# EAGLE schematic Beilage xx (EAGLE 9.6.2)
ABTEILUNG: Technische Informatik; BEARBEITER: Grundner, Ihninger; DATUM: 2021/11/6; DOKUMENTART: Schaltplan; GEZ: GruS; ID: 4AHEL; REV: 1; SCHALTPLAN: Sequencer; STATUS: Prototyp; VER: 1.0

## Sheet 1 of 10: Voltage Regulator PCB conversion From 12V AC input to: 1.33V 5V +12V -12V with buck Converters and Rectifiers
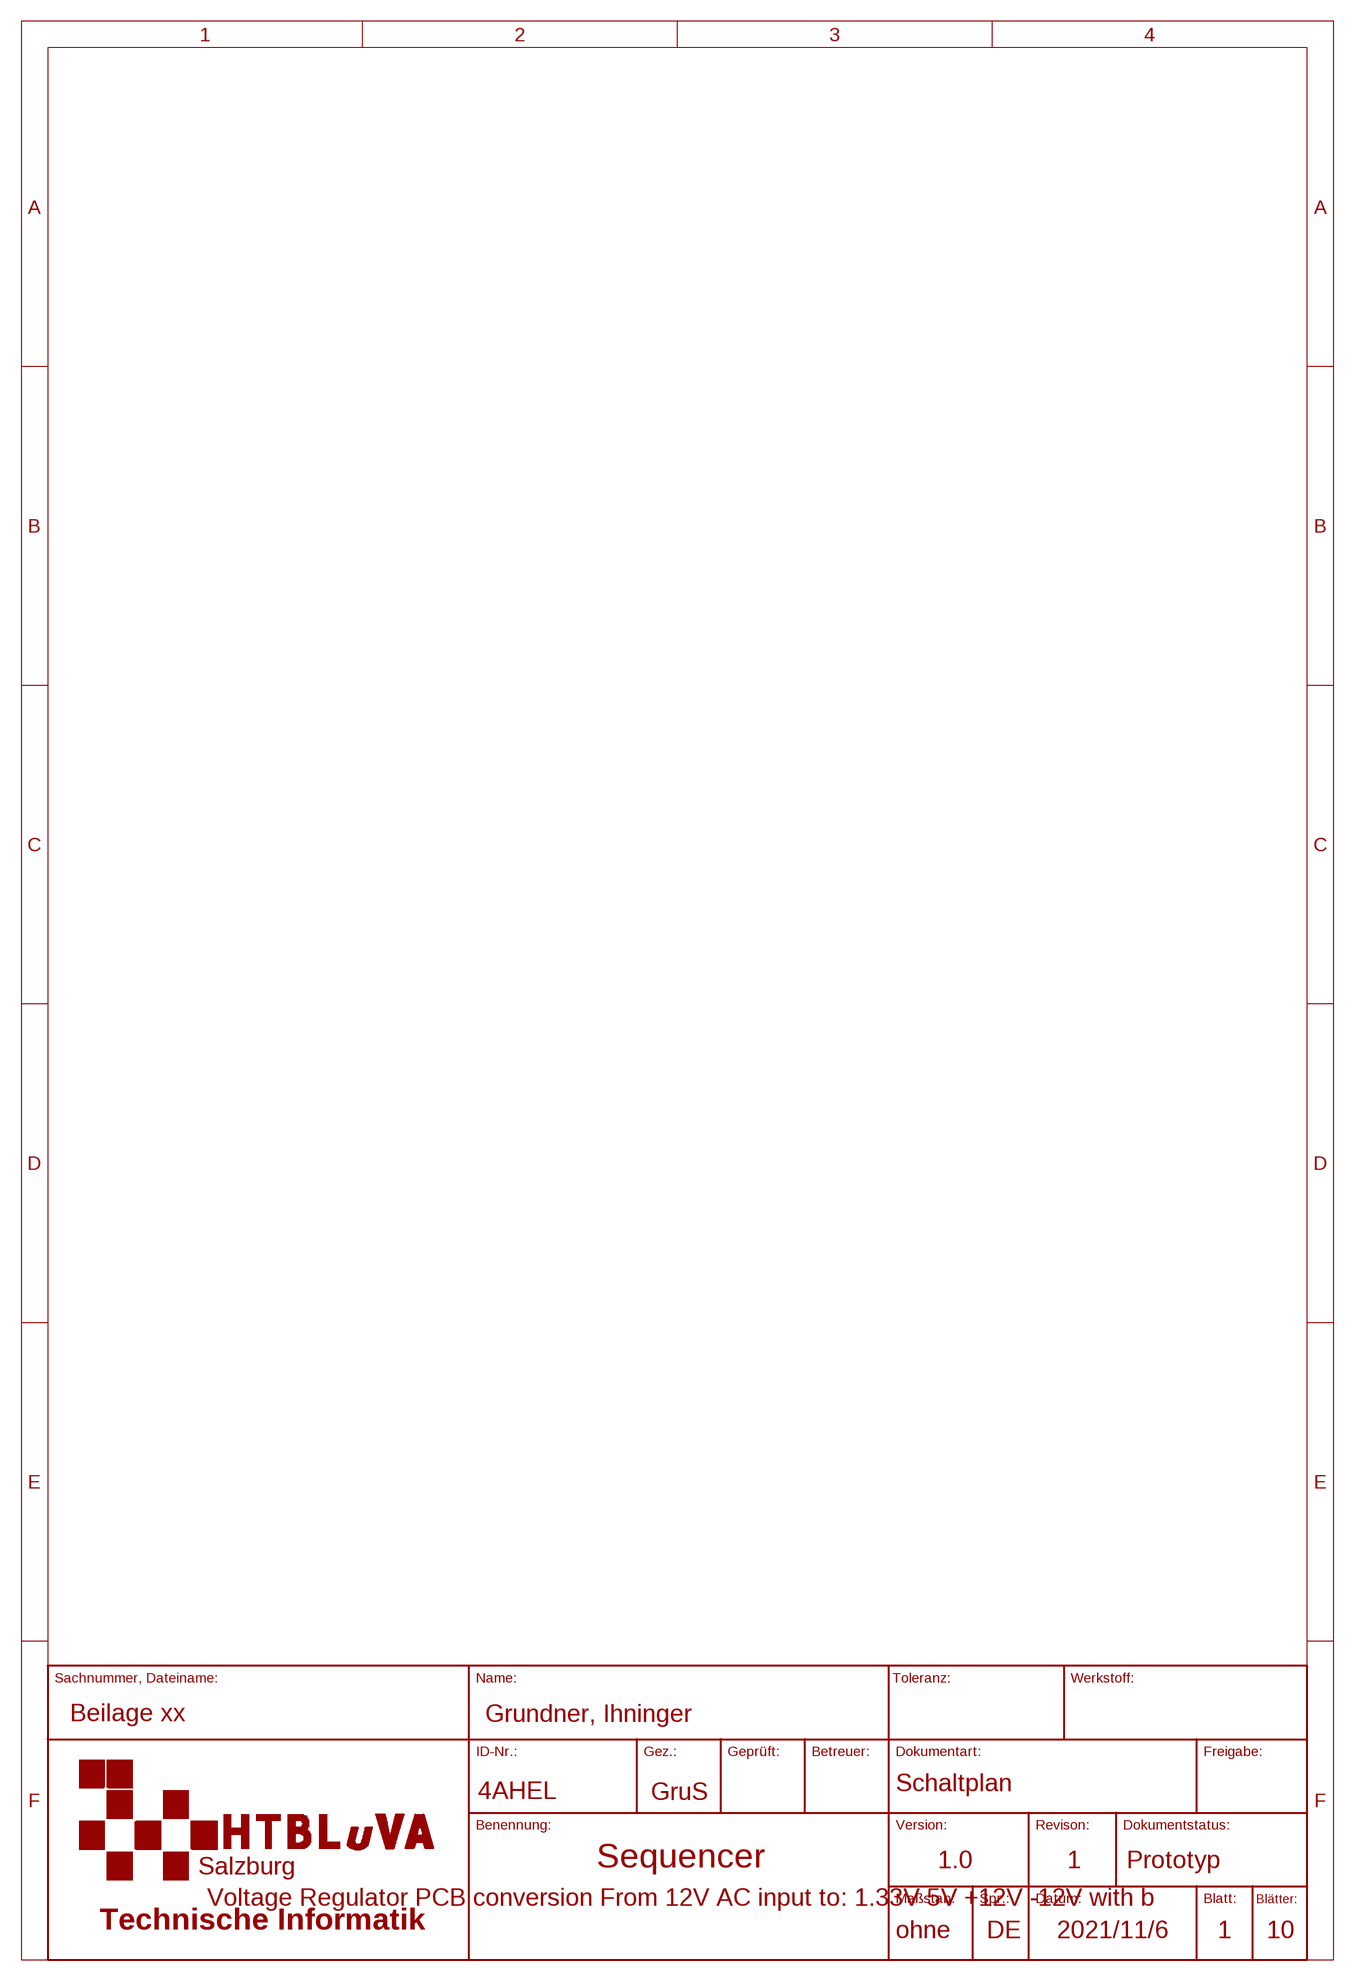
[diagram p0: schematic, sheet 1]

## Sheet 2 of 10: Jack Connector PCBs
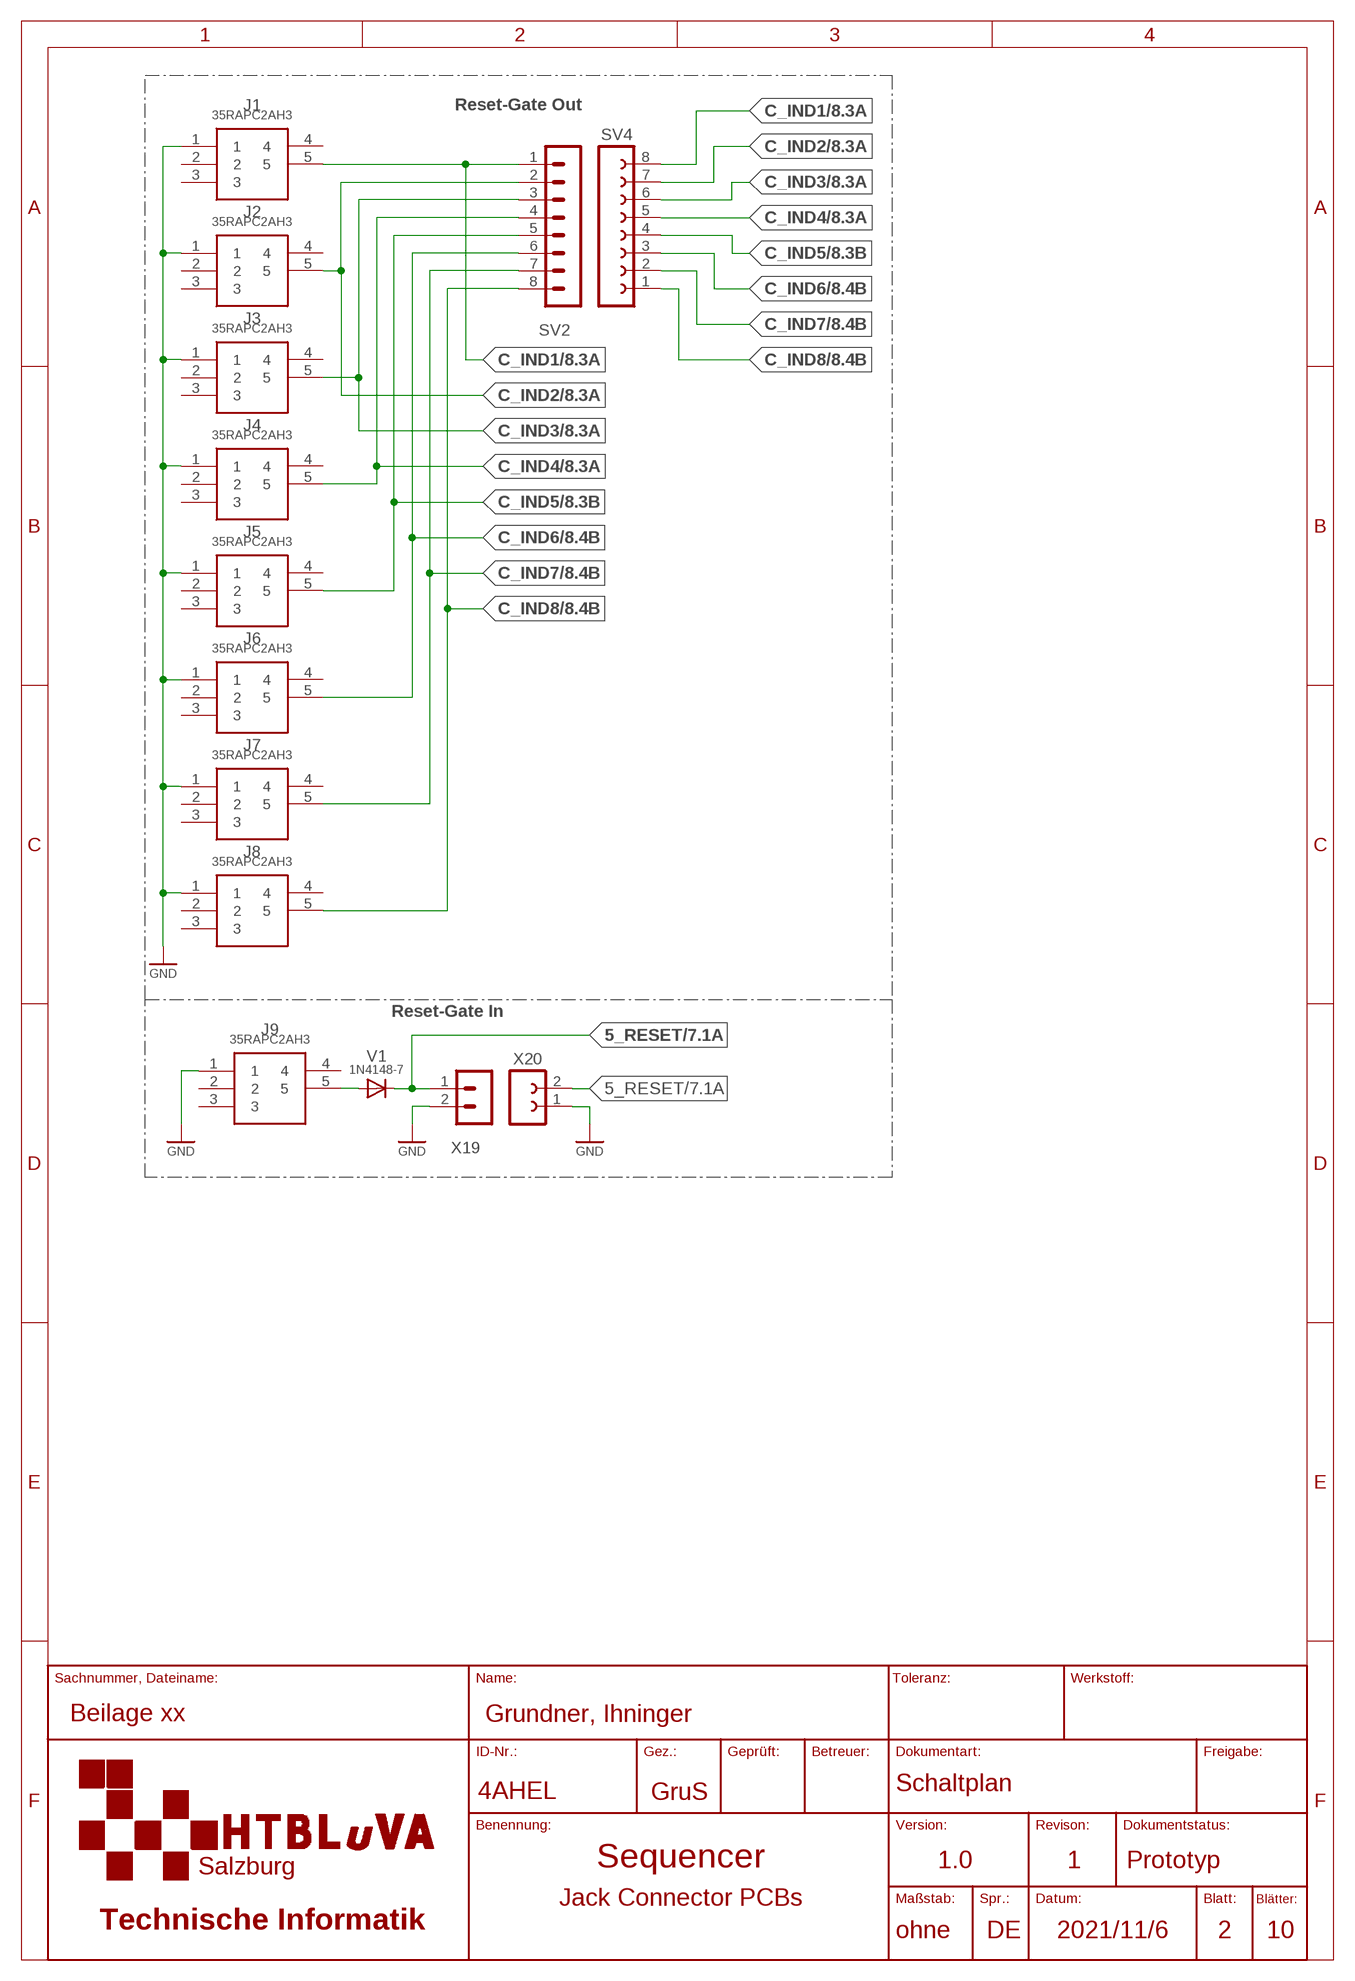
[diagram p1: schematic, sheet 2]

### Parts
J1  35RAPC2AH3  [35RAPC2AH3]
J2  35RAPC2AH3  [35RAPC2AH3]
J3  35RAPC2AH3  [35RAPC2AH3]
J4  35RAPC2AH3  [35RAPC2AH3]
J5  35RAPC2AH3  [35RAPC2AH3]
J6  35RAPC2AH3  [35RAPC2AH3]
J7  35RAPC2AH3  [35RAPC2AH3]
J8  35RAPC2AH3  [35RAPC2AH3]
J9  35RAPC2AH3  [35RAPC2AH3]
SV2  MA08-1W  [MA08-1W]
SV4  FE08-1  [FE08]
V1  1N4148-7  [DO35-7]
X19  MA02-1W  [MA02-1W]
X20  FE02-10.8MM  [FE02-1]

### Nets
5_RESET: V1.C X19.1 X20.2 ; also sheet 7,9
C_IND1: J1.5 SV2.1 SV4.8 ; also sheet 8
C_IND2: J2.5 SV2.2 SV4.7 ; also sheet 8
C_IND3: J3.5 SV2.3 SV4.6 ; also sheet 8
C_IND4: J4.5 SV2.4 SV4.5 ; also sheet 8
C_IND5: J5.5 SV2.5 SV4.4 ; also sheet 8
C_IND6: J6.5 SV2.6 SV4.3 ; also sheet 8
C_IND7: J7.5 SV2.7 SV4.2 ; also sheet 8
C_IND8: J8.5 SV2.8 SV4.1 ; also sheet 8
GND: J1.1 J2.1 J3.1 J4.1 J5.1 J6.1 J7.1 J8.1 J9.1 X19.2 X20.1 ; also sheet 3,4,5,6,7,8,9,10
N$98: J9.5 V1.A
Unconnected: J1.2 J1.3 J1.4 J2.2 J2.3 J2.4 J3.2 J3.3 J3.4 J4.2 J4.3 J4.4 J5.2 J5.3 J5.4 J6.2 J6.3 J6.4 J7.2 J7.3 J7.4 J8.2 J8.3 J8.4 J9.2 J9.3 J9.4

### Notes on the sheet
- Reset-Gate Out
- Reset-Gate In

## Sheet 3 of 10: Poti Connector PCBs Vertical PCBs to connect potis to Frontpanel
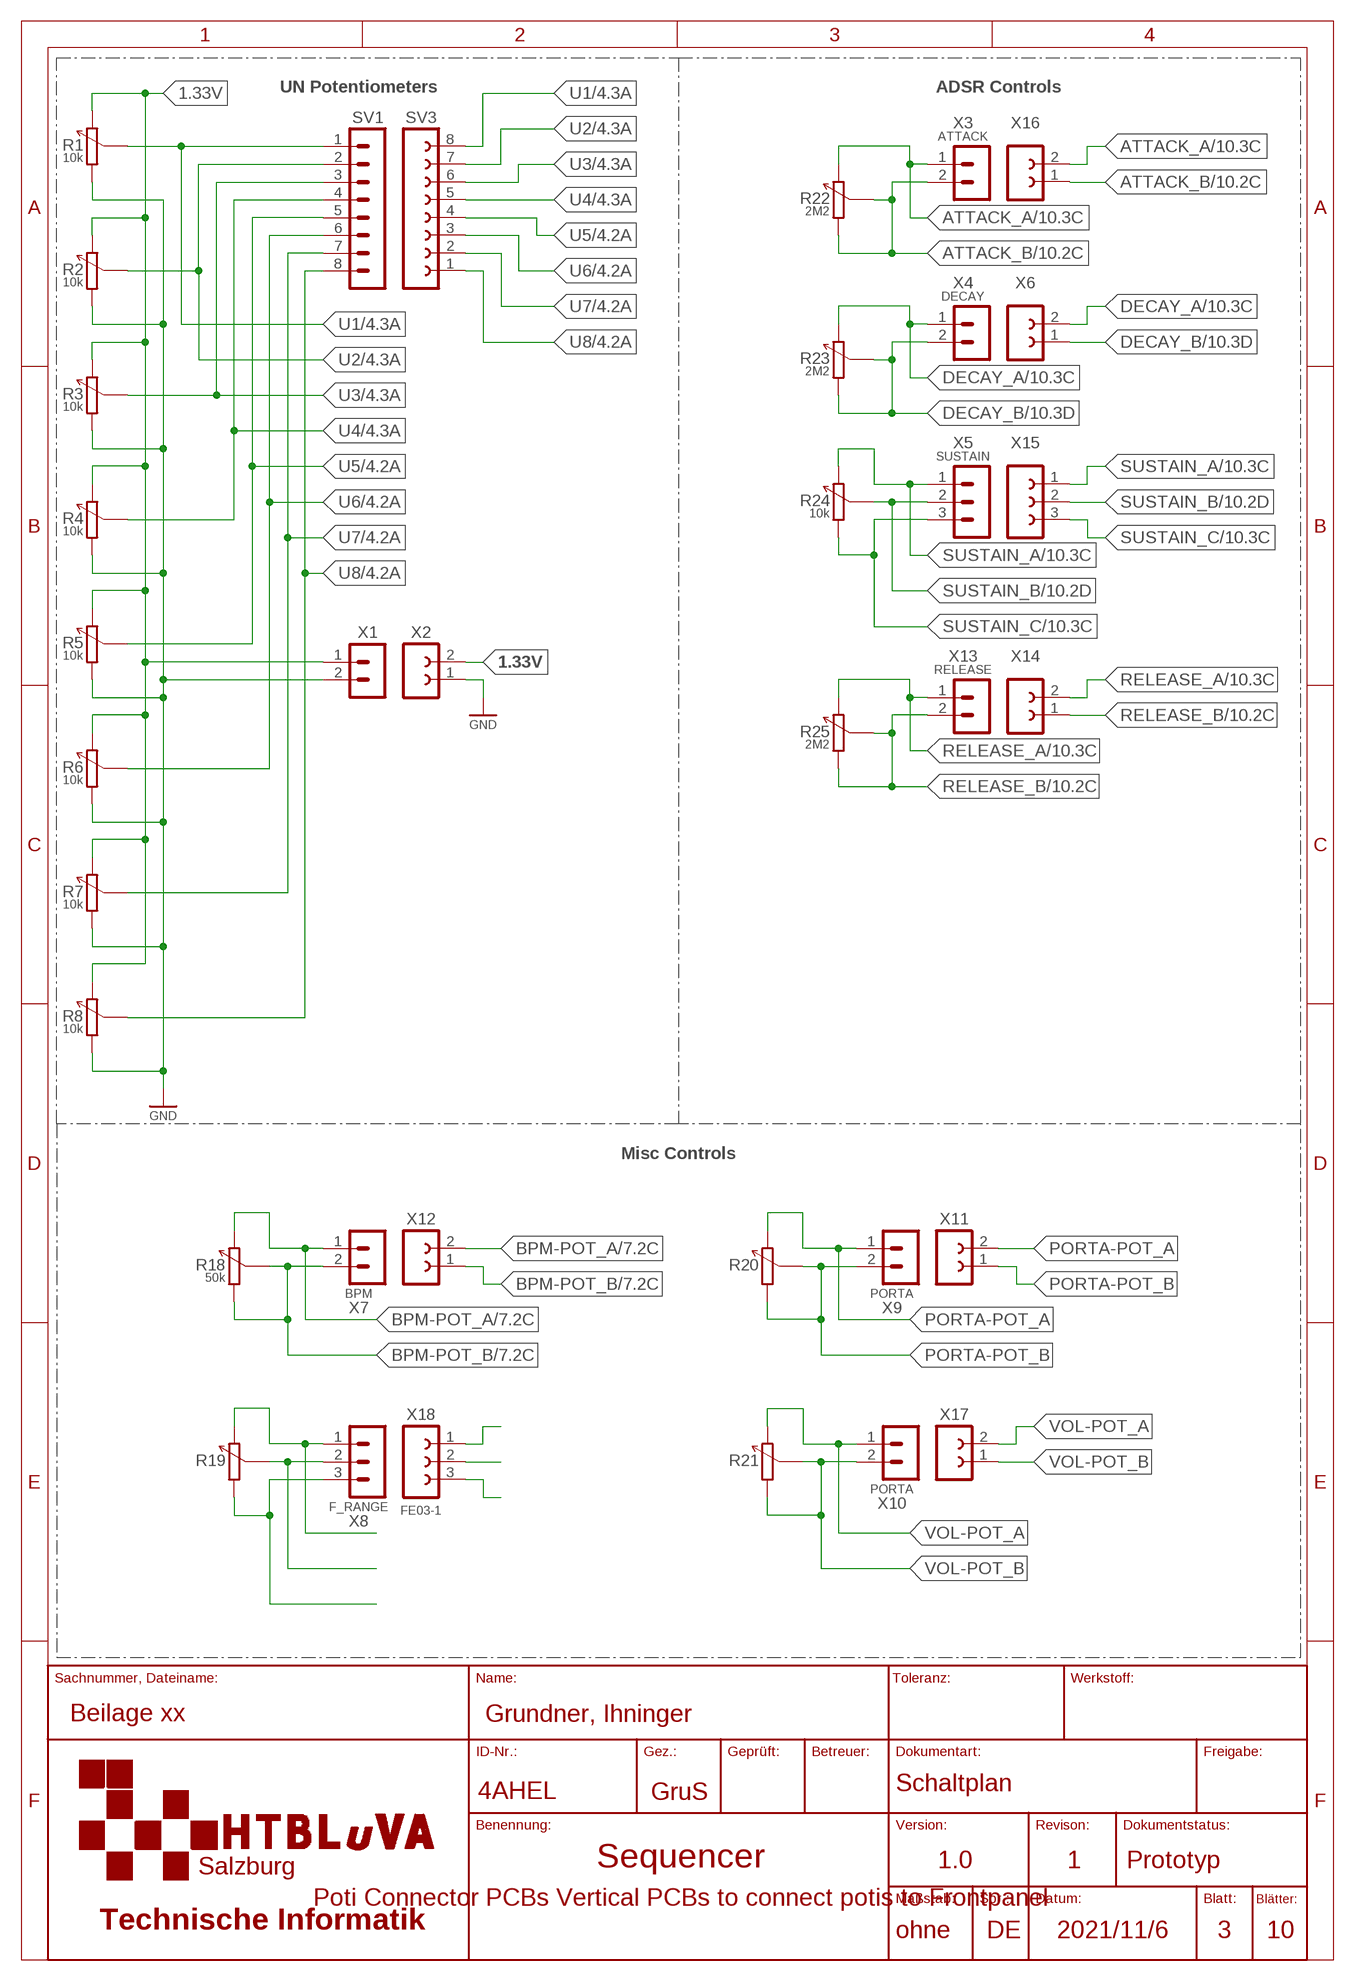
[diagram p2: schematic, sheet 3]

### Parts
R1  10k  R-POT  [R-POT-PANEL-MOUNT]
R2  10k  R-POT  [R-POT-PANEL-MOUNT]
R3  10k  R-POT  [R-POT-PANEL-MOUNT]
R4  10k  R-POT  [R-POT-PANEL-MOUNT]
R5  10k  R-POT  [R-POT-PANEL-MOUNT]
R6  10k  R-POT  [R-POT-PANEL-MOUNT]
R7  10k  R-POT  [R-POT-PANEL-MOUNT]
R8  10k  R-POT  [R-POT-PANEL-MOUNT]
R18  50k  R-POT  [R-POT-PANEL-MOUNT]
R19  R-POT  [R-POT-PANEL-MOUNT]
R20  R-POT  [R-POT-PANEL-MOUNT]
R21  R-POT  [R-POT-PANEL-MOUNT]
R22  2M2  R-POT  [R-POT-PANEL-MOUNT]
R23  2M2  R-POT  [R-POT-PANEL-MOUNT]
R24  10k  R-POT  [R-POT-PANEL-MOUNT]
R25  2M2  R-POT  [R-POT-PANEL-MOUNT]
SV1  MA08-1W  [MA08-1W]
SV3  FE08-1  [FE08]
X1  MA02-1W  [MA02-1W]
X2  FE02-10.8MM  [FE02-1]
X3  ATTACK  MA02-1W  [MA02-1W]
X4  DECAY  MA02-1W  [MA02-1W]
X5  SUSTAIN  MA03-1W  [MA03-1W]
X6  FE02-10.8MM  [FE02-1]
X7  BPM  MA02-1W  [MA02-1W]
X8  F_RANGE  MA03-1W  [MA03-1W]
X9  PORTA  MA02-1W  [MA02-1W]
X10  PORTA  MA02-1W  [MA02-1W]
X11  FE02-10.8MM  [FE02-1]
X12  FE02-10.8MM  [FE02-1]
X13  RELEASE  MA02-1W  [MA02-1W]
X14  FE02-10.8MM  [FE02-1]
X15  FE03-1  [FE03-1]
X16  FE02-10.8MM  [FE02-1]
X17  FE02-10.8MM  [FE02-1]
X18  FE03-1  [FE03-1]

### Nets
1.33V: R1.3 R2.3 R3.3 R4.3 R5.3 R6.3 R7.3 R8.3 X1.1 X2.2
ATTACK_A: R22.3 X3.1 X16.2 ; also sheet 10
ATTACK_B: R22.1 R22.2 X3.2 X16.1 ; also sheet 10
BPM-POT_A: R18.3 X7.1 X12.2 ; also sheet 7
BPM-POT_B: R18.1 R18.2 X7.2 X12.1 ; also sheet 7
DECAY_A: R23.3 X4.1 X6.2 ; also sheet 10
DECAY_B: R23.1 R23.2 X4.2 X6.1 ; also sheet 10
GND: R1.1 R2.1 R3.1 R4.1 R5.1 R6.1 R7.1 R8.1 X1.2 X2.1 ; also sheet 2,4,5,6,7,8,9,10
N$21: R19.2 X8.2
N$35: R19.1 X8.3
N$36: R19.3 X8.1
N$78: X18.1
N$80: X18.2
N$82: X18.3
PORTA-POT_A: R20.3 X9.1 X11.2
PORTA-POT_B: R20.1 R20.2 X9.2 X11.1
RELEASE_A: R25.3 X13.1 X14.2 ; also sheet 10
RELEASE_B: R25.1 R25.2 X13.2 X14.1 ; also sheet 10
SUSTAIN_A: R24.3 X5.1 X15.1 ; also sheet 10
SUSTAIN_B: R24.2 X5.2 X15.2 ; also sheet 10
SUSTAIN_C: R24.1 X5.3 X15.3 ; also sheet 10
U1: R1.2 SV1.1 SV3.8 ; also sheet 4
U2: R2.2 SV1.2 SV3.7 ; also sheet 4
U3: R3.2 SV1.3 SV3.6 ; also sheet 4
U4: R4.2 SV1.4 SV3.5 ; also sheet 4
U5: R5.2 SV1.5 SV3.4 ; also sheet 4
U6: R6.2 SV1.6 SV3.3 ; also sheet 4
U7: R7.2 SV1.7 SV3.2 ; also sheet 4
U8: R8.2 SV1.8 SV3.1 ; also sheet 4
VOL-POT_A: R21.3 X10.1 X17.2
VOL-POT_B: R21.1 R21.2 X10.2 X17.1

### Notes on the sheet
- UN Potentiometers | ADSR Controls
- Misc Controls

## Sheet 4 of 10: Main PCB: ASP Analog CV Input Signal Processing status LEDs
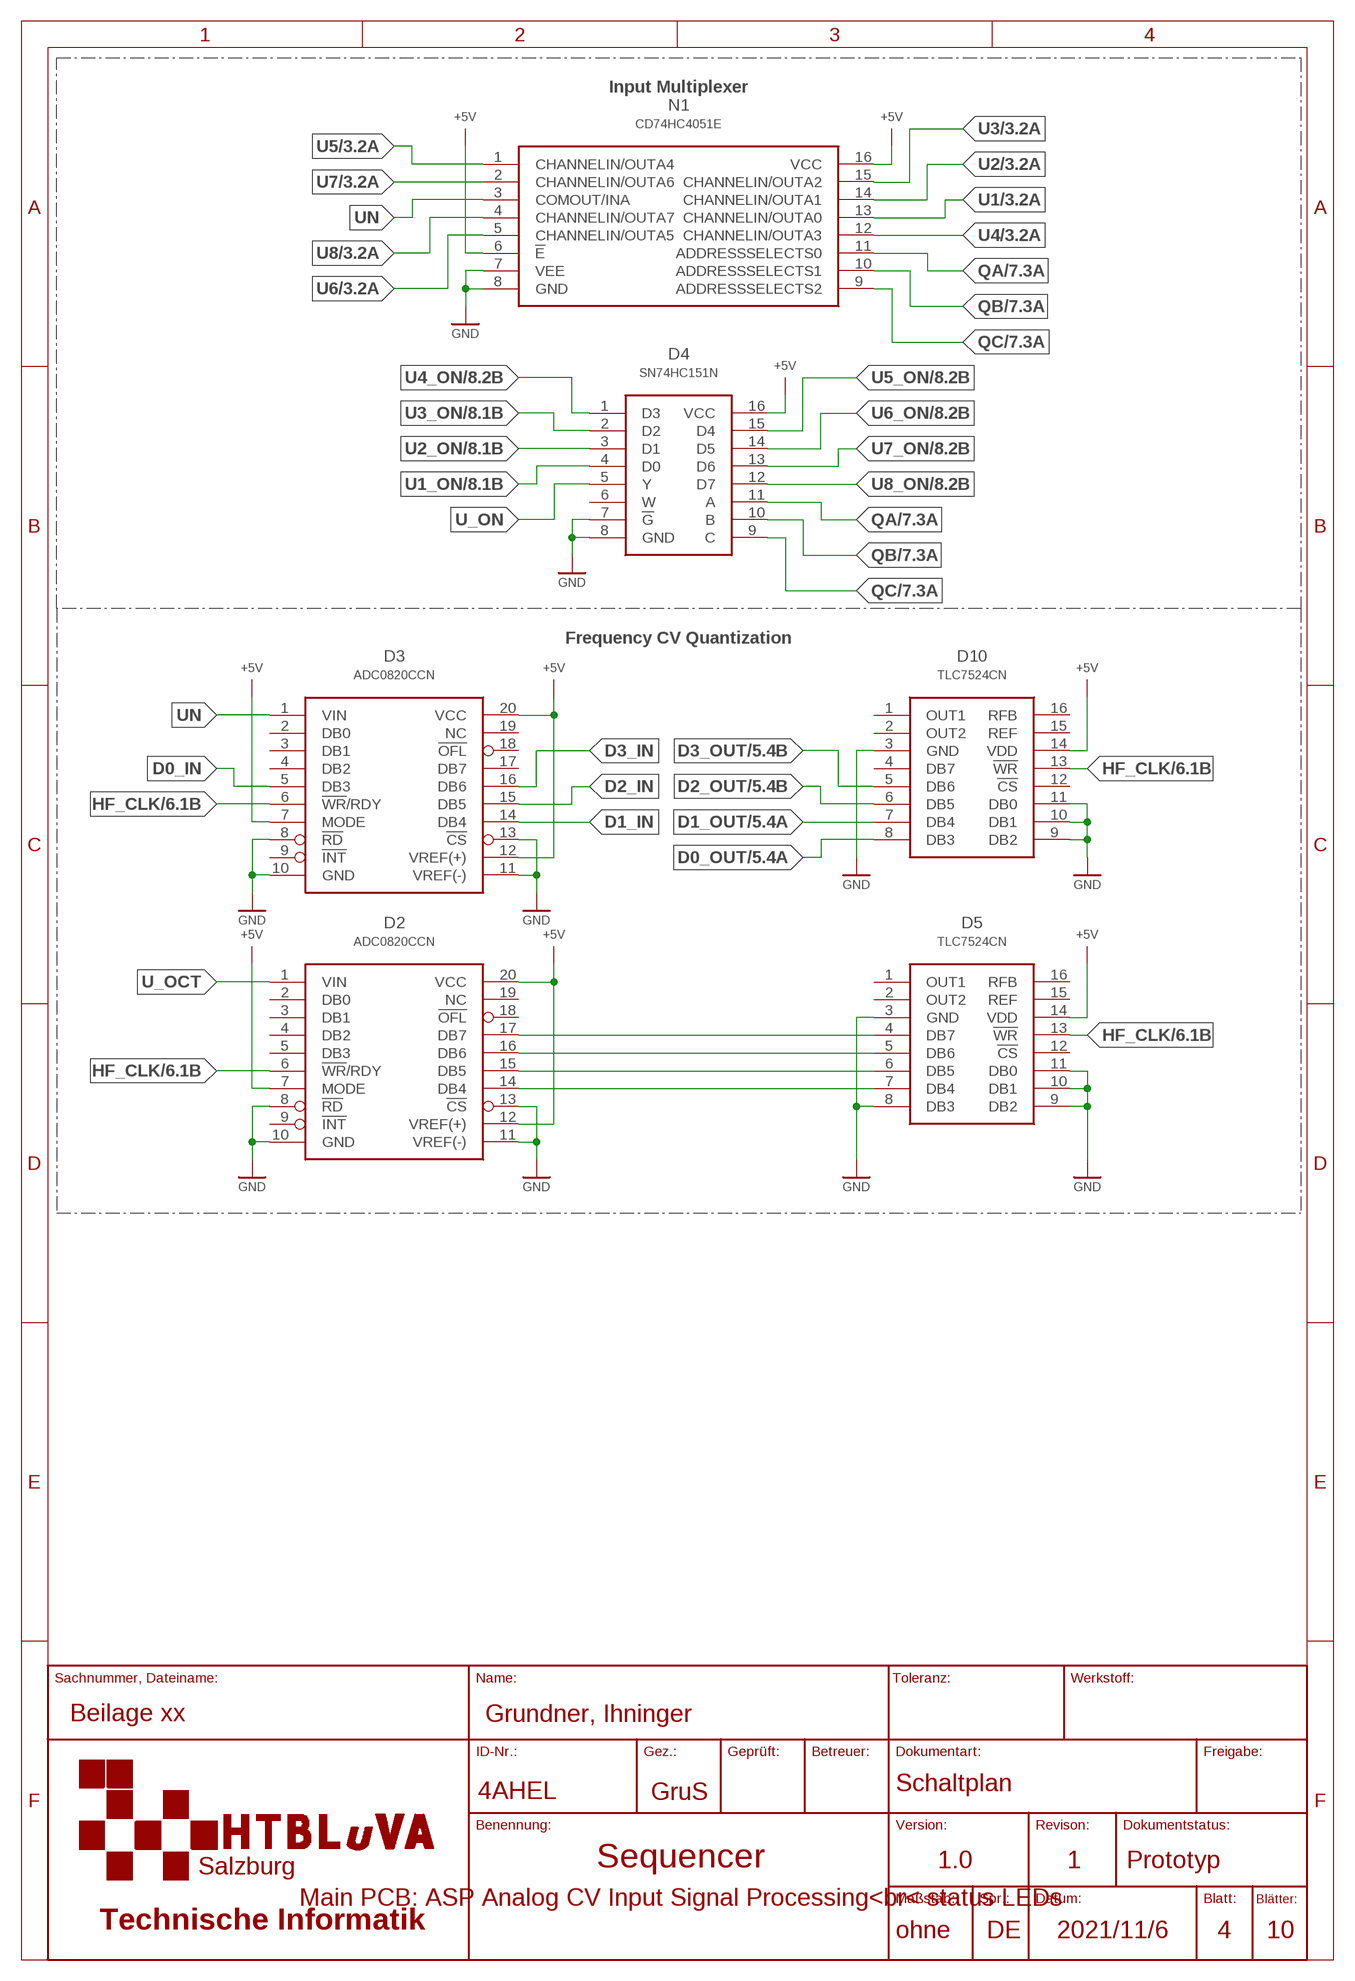
[diagram p3: schematic, sheet 4]

### Parts
D2  ADC0820CCN  [DIL20]
D3  ADC0820CCN  [DIL20]
D4  SN74HC151N  [DIP16]
D5  TLC7524CN  [DIL16]
D10  TLC7524CN  [DIL16]
N1  CD74HC4051E  [DIP16]

### Nets
+5V: D2.7(MODE) D2.12(VREF(+)) D2.20(VCC) D3.7(MODE) D3.12(VREF(+)) D3.20(VCC) D4.16(VCC) D5.14(VDD) D10.14(VDD) N1.6(!E) N1.16(VCC) ; also sheet 5,6,7,8,9
D0_IN: D3.5(DB3)
D0_OUT: D10.8(DB3) ; also sheet 5,6
D1_IN: D3.14(DB4)
D1_OUT: D10.7(DB4) ; also sheet 5,6
D2_IN: D3.15(DB5)
D2_OUT: D10.6(DB5) ; also sheet 5,6
D3_IN: D3.16(DB6)
D3_OUT: D10.5(DB6) ; also sheet 5,6
GND: D2.8(!RD) D2.10(GND) D2.11(VREF(-)) D2.13(!CS) D3.8(!RD) D3.10(GND) D3.11(VREF(-)) D3.13(!CS) D4.7(!G) D4.8(GND) D5.3(GND) D5.8(DB3) D5.9(DB2) D5.10(DB1) D5.11(DB0) D10.3(GND) D10.9(DB2) D10.10(DB1) D10.11(DB0) N1.7(VEE) N1.8(GND) ; also sheet 2,3,5,6,7,8,9,10
HF_CLK: D2.6(!WR!/RDY) D3.6(!WR!/RDY) D5.13(!WR) D10.13(!WR) ; also sheet 6
N$2: D2.14(DB4) D5.7(DB4)
N$3: D2.15(DB5) D5.6(DB5)
N$4: D2.16(DB6) D5.5(DB6)
N$6: D2.17(DB7) D5.4(DB7)
QA: D4.11(A) N1.11(ADDRESSSELECTS0) ; also sheet 7,8
QB: D4.10(B) N1.10(ADDRESSSELECTS1) ; also sheet 7,8
QC: D4.9(C) N1.9(ADDRESSSELECTS2) ; also sheet 7,8
U1: N1.13(CHANNELIN/OUTA0) ; also sheet 3
U1_ON: D4.4(D0) ; also sheet 8,9
U2: N1.14(CHANNELIN/OUTA1) ; also sheet 3
U2_ON: D4.3(D1) ; also sheet 8,9
U3: N1.15(CHANNELIN/OUTA2) ; also sheet 3
U3_ON: D4.2(D2) ; also sheet 8,9
U4: N1.12(CHANNELIN/OUTA3) ; also sheet 3
U4_ON: D4.1(D3) ; also sheet 8,9
U5: N1.1(CHANNELIN/OUTA4) ; also sheet 3
U5_ON: D4.15(D4) ; also sheet 8,9
U6: N1.5(CHANNELIN/OUTA5) ; also sheet 3
U6_ON: D4.14(D5) ; also sheet 8,9
U7: N1.2(CHANNELIN/OUTA6) ; also sheet 3
U7_ON: D4.13(D6) ; also sheet 8,9
U8: N1.4(CHANNELIN/OUTA7) ; also sheet 3
U8_ON: D4.12(D7) ; also sheet 8,9
U_OCT: D2.1(VIN)
U_ON: D4.5(Y)
UN: D3.1(VIN) N1.3(COMOUT/INA)
Unconnected: D2.2(DB0) D2.3(DB1) D2.4(DB2) D2.5(DB3) D2.9(!INT) D2.18(!OFL) D2.19(NC) D3.2(DB0) D3.3(DB1) D3.4(DB2) D3.9(!INT) D3.17(DB7) D3.18(!OFL) D3.19(NC) D4.6(W) D5.1(OUT1) D5.2(OUT2) D5.12(!CS) D5.15(REF) D5.16(RFB) D10.1(OUT1) D10.2(OUT2) D10.4(DB7) D10.12(!CS) D10.15(REF) D10.16(RFB)

### Notes on the sheet
- Input Multiplexer
- Frequency CV Quantization

## Sheet 5 of 10: Main PCB: DSP1 Scale Filter Processor Bus Switch Binary Mode Filters
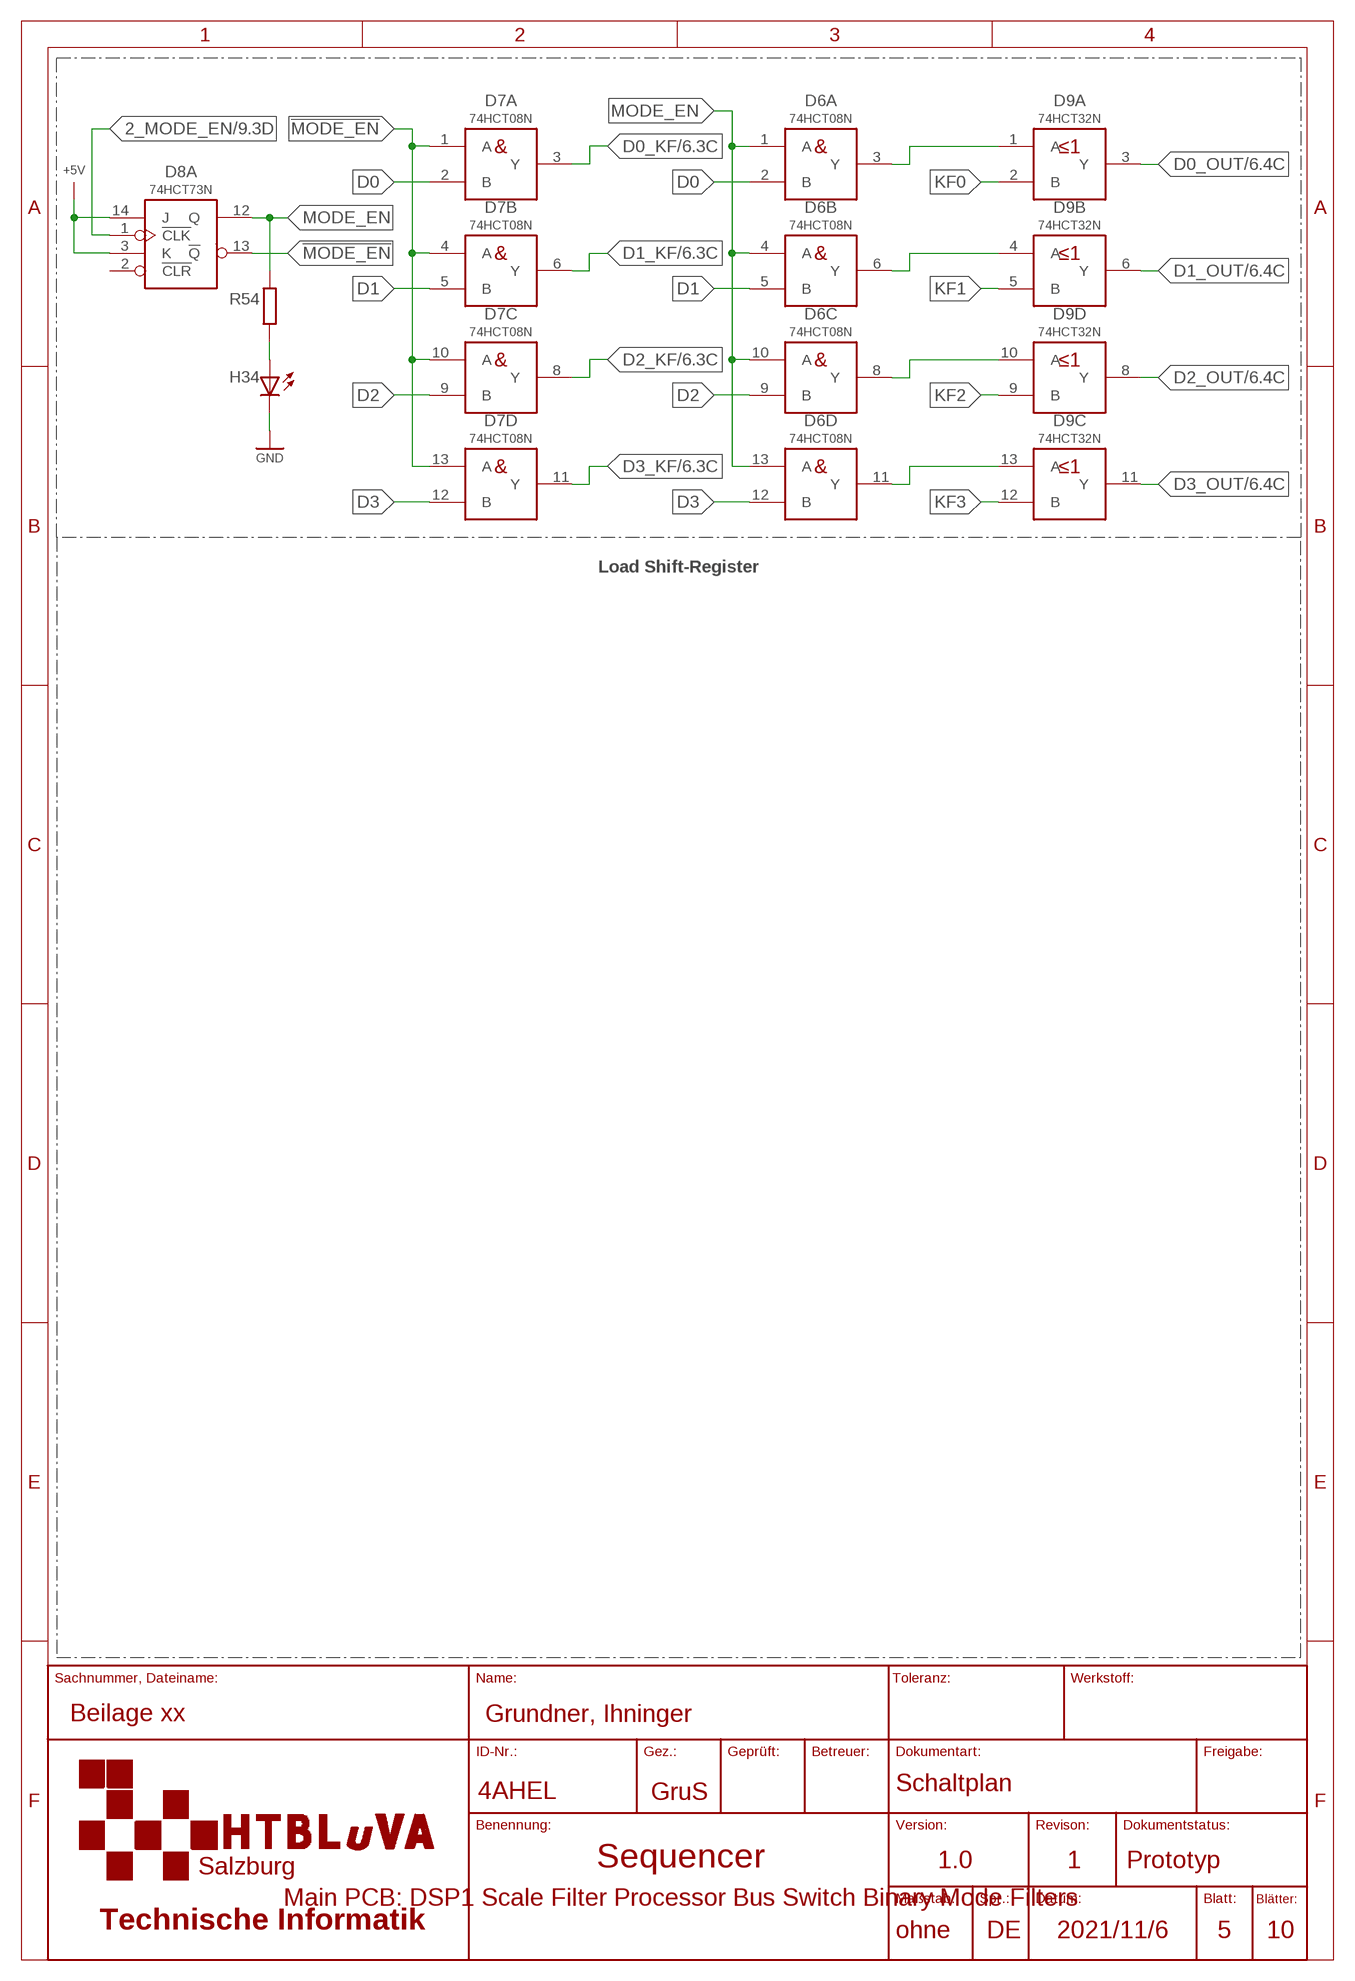
[diagram p4: schematic, sheet 5]

### Parts
D6  74HCT08N  [DIP14]
D7  74HCT08N  [DIP14]
D8  74HCT73N  [DIP14]
D9  74HCT32N  [DIP14]
H34  LED5MM  [LED5MM]
R54  R-EUSR1206  [R1206]

### Nets
2_MODE_EN: D8.1(A:!CLK) ; also sheet 9
!MODE_EN: D7.1(A:A) D7.4(B:A) D7.10(C:A) D7.13(D:A) D8.13(A:!Q)
+5V: D8.3(A:K) D8.14(A:J) ; also sheet 4,6,7,8,9
D0: D6.2(A:B) D7.2(A:B)
D0_KF: D7.3(A:Y) ; also sheet 6
D0_OUT: D9.3(A:Y) ; also sheet 4,6
D1: D6.5(B:B) D7.5(B:B)
D1_KF: D7.6(B:Y) ; also sheet 6
D1_OUT: D9.6(B:Y) ; also sheet 4,6
D2: D6.9(C:B) D7.9(C:B)
D2_KF: D7.8(C:Y) ; also sheet 6
D2_OUT: D9.8(D:Y) ; also sheet 4,6
D3: D6.12(D:B) D7.12(D:B)
D3_KF: D7.11(D:Y) ; also sheet 6
D3_OUT: D9.11(C:Y) ; also sheet 4,6
GND: H34.K(C) ; also sheet 2,3,4,6,7,8,9,10
KF0: D9.2(A:B)
KF1: D9.5(B:B)
KF2: D9.9(D:B)
KF3: D9.12(C:B)
MODE_EN: D6.1(A:A) D6.4(B:A) D6.10(C:A) D6.13(D:A) D8.12(A:Q) R54.2
N$37: D6.3(A:Y) D9.1(A:A)
N$39: D6.6(B:Y) D9.4(B:A)
N$42: D6.8(C:Y) D9.10(D:A)
N$43: D6.11(D:Y) D9.13(C:A)
N$99: H34.A R54.1
Unconnected: D8.2(A:!CLR) D8.5(B:!CLK) D8.6(B:!CLR) D8.7(B:J) D8.8(B:!Q) D8.9(B:Q) D8.10(B:K)

### Notes on the sheet
- Load Shift-Register

## Sheet 6 of 10: Main PCB: DSP2 Key Filter Processor
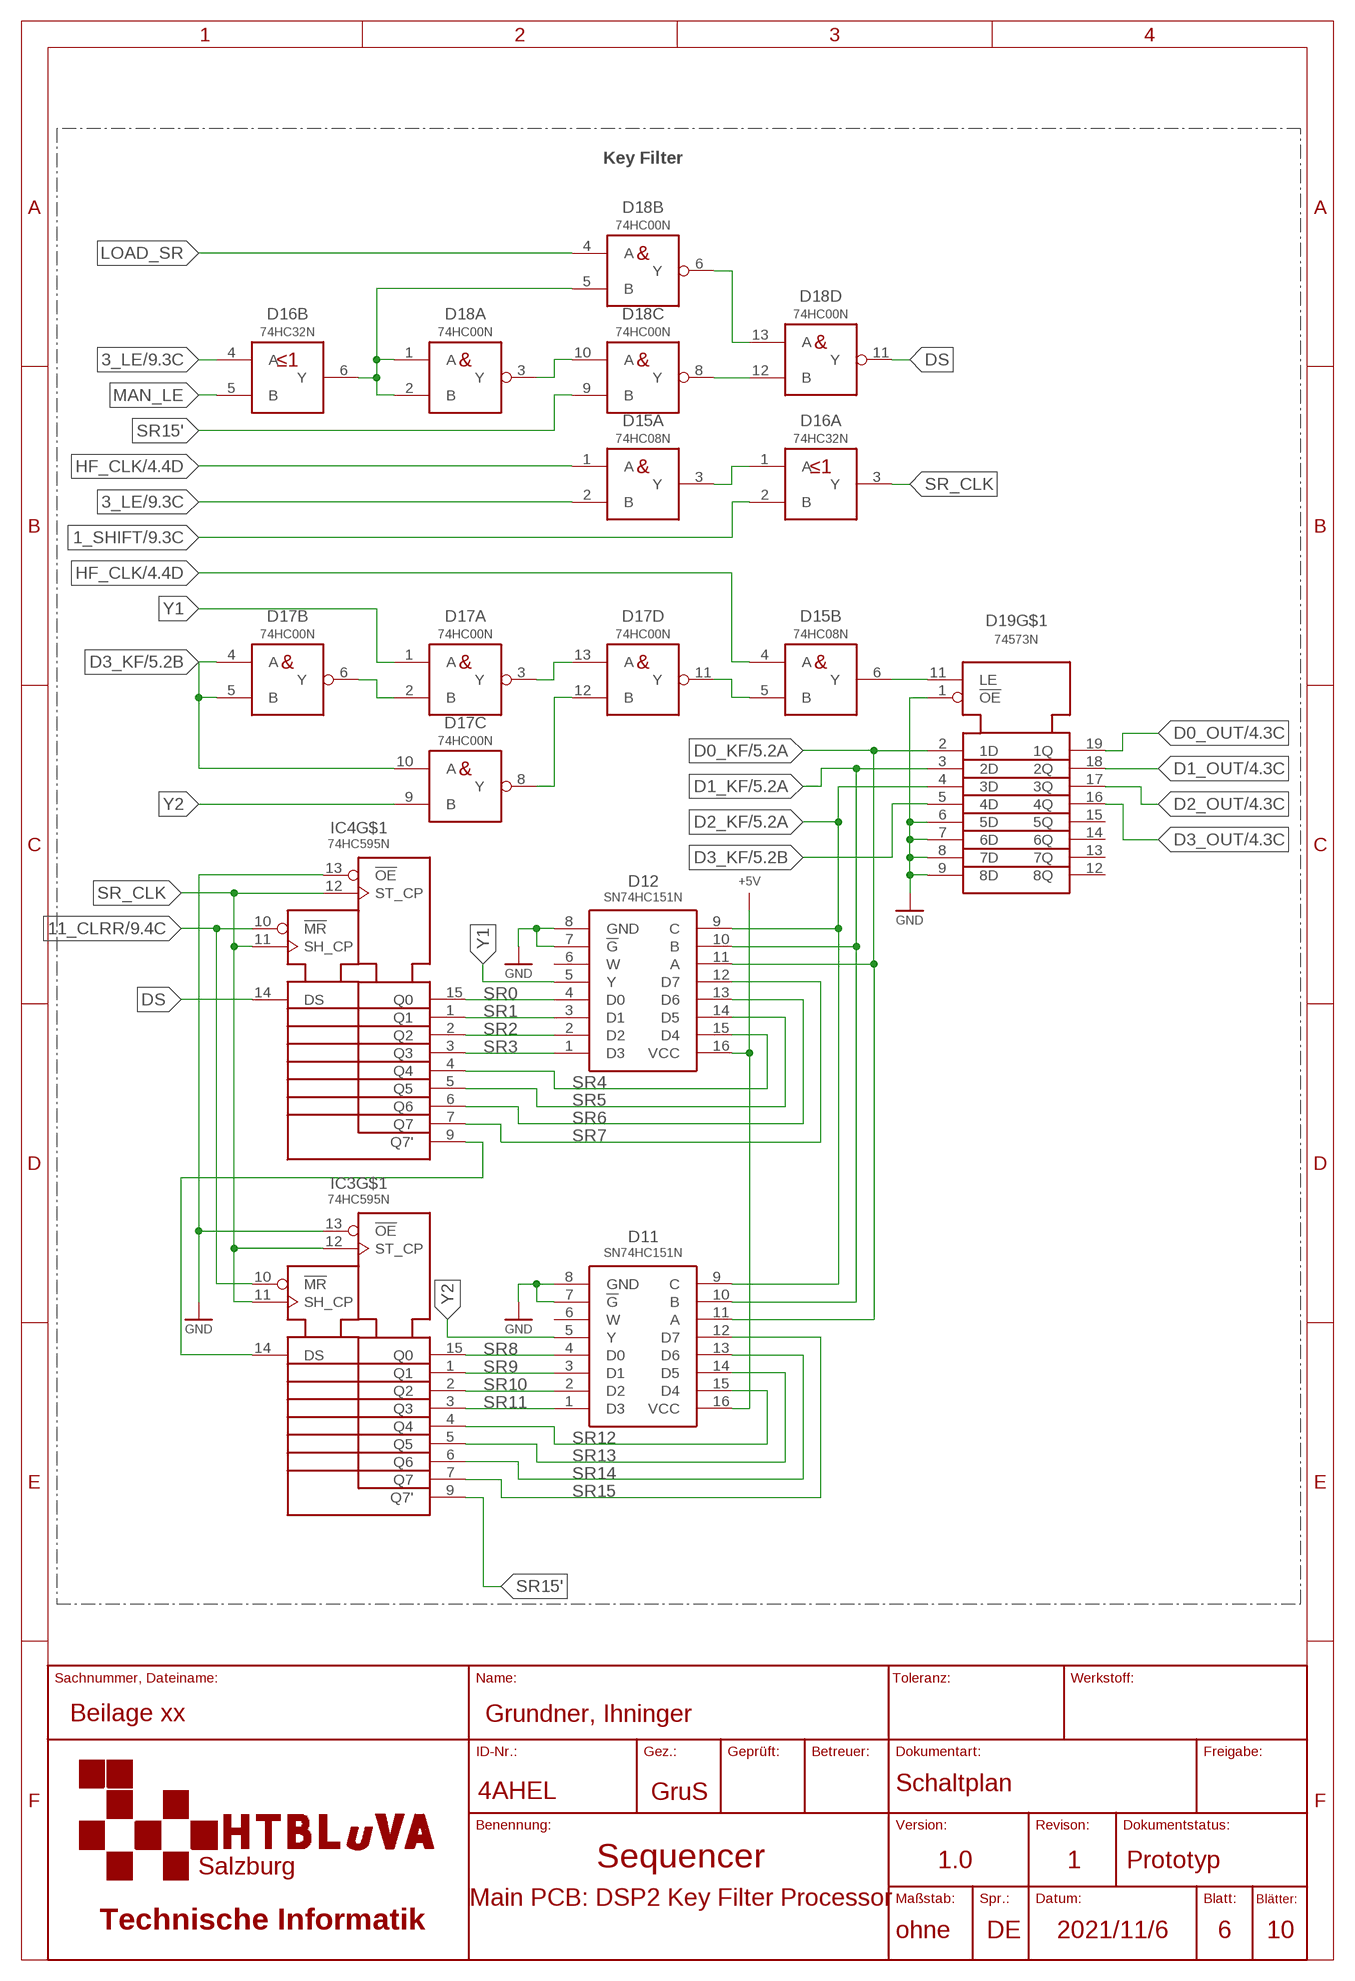
[diagram p5: schematic, sheet 6]

### Parts
D11  SN74HC151N  [DIP16]
D12  SN74HC151N  [DIP16]
D15  74HC08N  [DIP14]
D16  74HC32N  [DIP14]
D17  74HC00N  [DIP14]
D18  74HC00N  [DIP14]
D19  74573N  [DIP20]
IC3  74HC595N  [DIP16]
IC4  74HC595N  [DIP16]

### Nets
1_SHIFT: D16.2(A:B) ; also sheet 9
3_LE: D15.2(A:B) D16.4(B:A) ; also sheet 9
11_CLRR: IC3.10(!MR) IC4.10(!MR) ; also sheet 9
+5V: D11.16(VCC) D12.16(VCC) ; also sheet 4,5,7,8,9
D0_KF: D11.11(A) D12.11(A) D19.2(1D) ; also sheet 5
D0_OUT: D19.19(1Q) ; also sheet 4,5
D1_KF: D11.10(B) D12.10(B) D19.3(2D) ; also sheet 5
D1_OUT: D19.18(2Q) ; also sheet 4,5
D2_KF: D11.9(C) D12.9(C) D19.4(3D) ; also sheet 5
D2_OUT: D19.17(3Q) ; also sheet 4,5
D3_KF: D17.4(B:A) D17.5(B:B) D17.10(C:A) D19.5(4D) ; also sheet 5
D3_OUT: D19.16(4Q) ; also sheet 4,5
DS: D18.11(D:Y) IC4.14(DS)
GND: D11.7(!G) D11.8(GND) D12.7(!G) D12.8(GND) D19.1(!OE) D19.6(5D) D19.7(6D) D19.8(7D) D19.9(8D) IC3.13(!OE) IC4.13(!OE) ; also sheet 2,3,4,5,7,8,9,10
HF_CLK: D15.1(A:A) D15.4(B:A) ; also sheet 4
LOAD_SR: D18.4(B:A)
MAN_LE: D16.5(B:B)
N$40: D15.3(A:Y) D16.1(A:A)
N$41: D18.3(A:Y) D18.10(C:A)
N$44: D17.3(A:Y) D17.13(D:A)
N$45: D17.8(C:Y) D17.12(D:B)
N$46: D18.6(B:Y) D18.13(D:A)
N$47: D18.8(C:Y) D18.12(D:B)
N$48: D15.5(B:B) D17.11(D:Y)
N$50: D16.6(B:Y) D18.1(A:A) D18.2(A:B) D18.5(B:B)
N$52: D17.2(A:B) D17.6(B:Y)
N$89: IC3.14(DS) IC4.9(Q7')
N$90: D15.6(B:Y) D19.11(LE)
SR0: D12.4(D0) IC4.15(Q0) ; also sheet 8
SR1: D12.3(D1) IC4.1(Q1) ; also sheet 8
SR2: D12.2(D2) IC4.2(Q2) ; also sheet 8
SR3: D12.1(D3) IC4.3(Q3) ; also sheet 8
SR4: D12.15(D4) IC4.4(Q4) ; also sheet 8
SR5: D12.14(D5) IC4.5(Q5) ; also sheet 8
SR6: D12.13(D6) IC4.6(Q6) ; also sheet 8
SR7: D12.12(D7) IC4.7(Q7) ; also sheet 8
SR8: D11.4(D0) IC3.15(Q0) ; also sheet 8
SR9: D11.3(D1) IC3.1(Q1) ; also sheet 8
SR10: D11.2(D2) IC3.2(Q2) ; also sheet 8
SR11: D11.1(D3) IC3.3(Q3) ; also sheet 8
SR12: D11.15(D4) IC3.4(Q4) ; also sheet 8
SR13: D11.14(D5) IC3.5(Q5) ; also sheet 8
SR14: D11.13(D6) IC3.6(Q6) ; also sheet 8
SR15: D11.12(D7) IC3.7(Q7) ; also sheet 8
SR15': D18.9(C:B) IC3.9(Q7')
SR_CLK: D16.3(A:Y) IC3.11(SH_CP) IC3.12(ST_CP) IC4.11(SH_CP) IC4.12(ST_CP)
Y1: D12.5(Y) D17.1(A:A)
Y2: D11.5(Y) D17.9(C:B)
Unconnected: D11.6(W) D12.6(W) D15.8(C:Y) D15.9(C:B) D15.10(C:A) D15.11(D:Y) D15.12(D:B) D15.13(D:A) D16.8(D:Y) D16.9(D:B) D16.10(D:A) D16.11(C:Y) D16.12(C:B) D16.13(C:A) D19.12(8Q) D19.13(7Q) D19.14(6Q) D19.15(5Q)

### Notes on the sheet
- Key Filter

## Sheet 7 of 10: Clocks and Counters BPM Settings: Prescaling Gate Settings: On Times
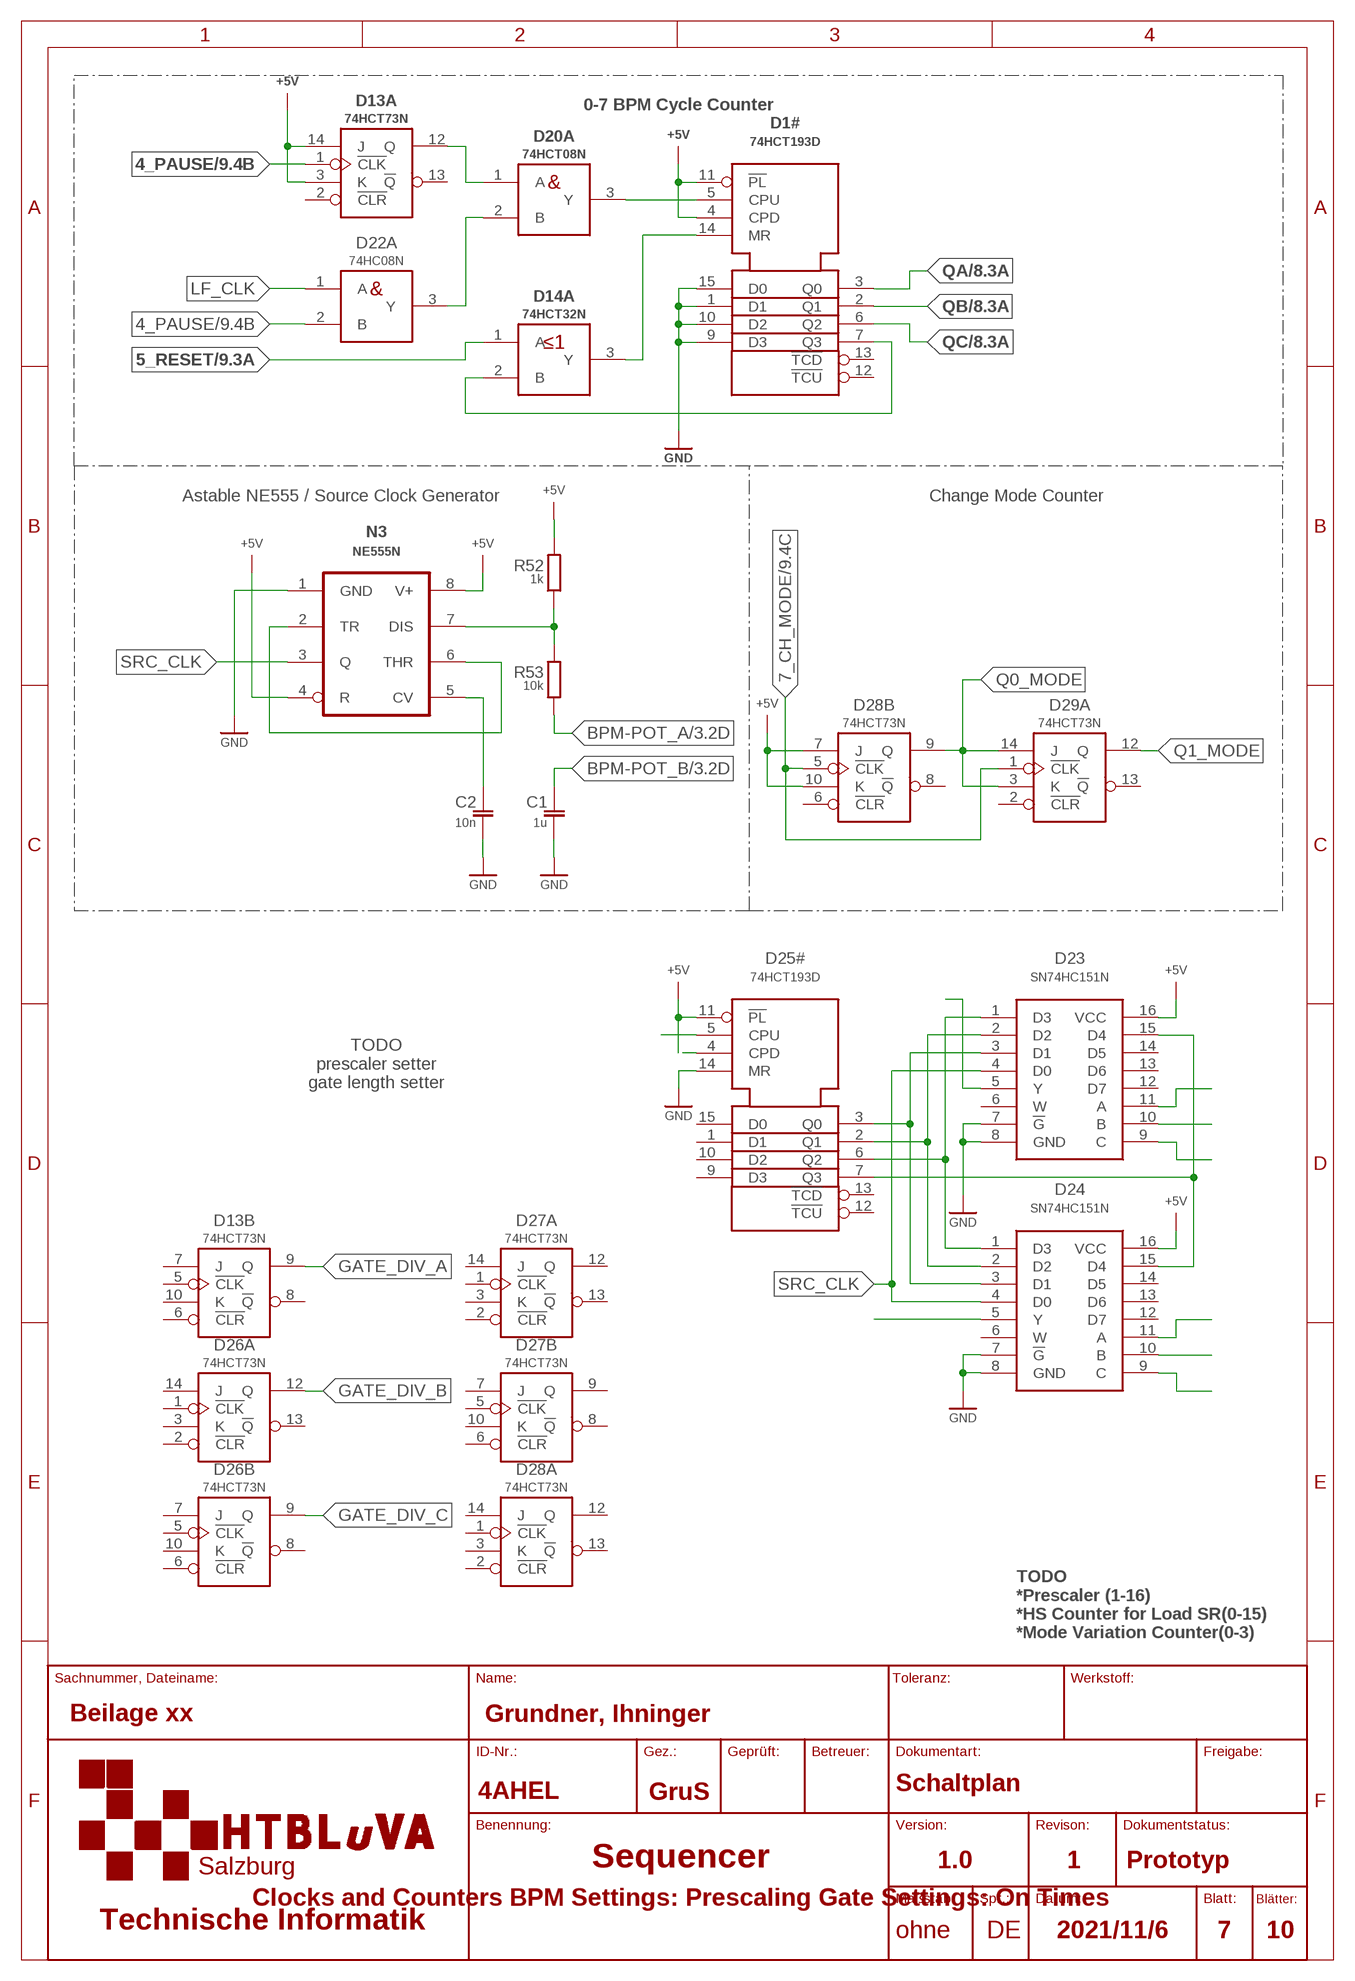
[diagram p6: schematic, sheet 7]

### Parts
C1  1u  C-EU050-025X075  [C050-025X075]
C2  10n  C-EU050-025X075  [C050-025X075]
D1  74HCT193D  [SO16]
D13  74HCT73N  [DIP14]
D14  74HCT32N  [DIP14]
D20  74HCT08N  [DIP14]
D22  74HC08N  [DIP14]
D23  SN74HC151N  [DIP16]
D24  SN74HC151N  [DIP16]
D25  74HCT193D  [SO16]
D26  74HCT73N  [DIP14]
D27  74HCT73N  [DIP14]
D28  74HCT73N  [DIP14]
D29  74HCT73N  [DIP14]
N3  NE555N  [DIL08]
R52  1k  R-EUSR1206  [R1206]
R53  10k  R-EUSR1206  [R1206]

### Nets
4_PAUSE: D13.1(A:!CLK) D22.2(A:B) ; also sheet 9
5_RESET: D14.1(A:A) ; also sheet 2,9
7_CH_MODE: D28.5(B:!CLK) D29.1(A:!CLK) ; also sheet 9
+5V: D1.4(#:CPD) D1.11(#:!PL) D13.3(A:K) D13.14(A:J) D23.16(VCC) D24.16(VCC) D25.4(#:CPD) D25.11(#:!PL) D28.7(B:J) D28.10(B:K) N3.4(R) N3.8(V+) R52.2 ; also sheet 4,5,6,8,9
BPM-POT_A: R53.1 ; also sheet 3
BPM-POT_B: C1.1 ; also sheet 3
BPM_CNT_CLK: D20.2(A:B) D22.3(A:Y)
GATE_DIV_A: D13.9(B:Q)
GATE_DIV_B: D26.12(A:Q)
GATE_DIV_C: D26.9(B:Q)
GND: C1.2 C2.2 D1.1(#:D1) D1.9(#:D3) D1.10(#:D2) D1.15(#:D0) D23.7(!G) D23.8(GND) D24.7(!G) D24.8(GND) D25.14(#:MR) N3.1(GND) ; also sheet 2,3,4,5,6,8,9,10
LF_CLK: D22.1(A:A)
N$5: D1.7(#:Q3) D14.2(A:B)
N$10: D23.5(Y)
N$20: D24.5(Y)
N$22: D25.5(#:CPU)
N$26: D24.11(A)
N$27: D24.10(B)
N$28: D24.9(C)
N$29: D23.1(D3) D24.1(D3) D25.6(#:Q2)
N$30: D23.9(C)
N$31: D23.10(B)
N$32: D23.11(A)
N$49: D23.2(D2) D24.2(D2) D25.2(#:Q1)
N$57: D23.3(D1) D24.3(D1) D25.3(#:Q0)
N$59: D23.15(D4) D24.15(D4) D25.7(#:Q3)
N$91: D1.5(#:CPU) D20.3(A:Y)
N$92: D13.12(A:Q) D20.1(A:A)
N$94: D1.14(#:MR) D14.3(A:Y)
N$96: N3.2(TR) N3.6(THR)
N$97: N3.7(DIS) R52.1 R53.2
N$100: C2.1 N3.5(CV)
Q0_MODE: D28.9(B:Q) D29.3(A:K) D29.14(A:J)
Q1_MODE: D29.12(A:Q)
QA: D1.3(#:Q0) ; also sheet 4,8
QB: D1.2(#:Q1) ; also sheet 4,8
QC: D1.6(#:Q2) ; also sheet 4,8
SRC_CLK: D23.4(D0) D24.4(D0) N3.3(Q)
Unconnected: D1.12(#:!TCU) D1.13(#:!TCD) D13.2(A:!CLR) D13.5(B:!CLK) D13.6(B:!CLR) D13.7(B:J) D13.8(B:!Q) D13.10(B:K) D13.13(A:!Q) D14.4(B:A) D14.5(B:B) D14.6(B:Y) D14.8(D:Y) D14.9(D:B) D14.10(D:A) D14.11(C:Y) D14.12(C:B) D14.13(C:A) D20.4(B:A) D20.5(B:B) D20.6(B:Y) D20.8(C:Y) D20.9(C:B) D20.10(C:A) D20.11(D:Y) D20.12(D:B) D20.13(D:A) D22.4(B:A) D22.5(B:B) D22.6(B:Y) D22.8(C:Y) D22.9(C:B) D22.10(C:A) D22.11(D:Y) D22.12(D:B) D22.13(D:A) D23.6(W) D23.12(D7) D23.13(D6) D23.14(D5) D24.6(W) D24.12(D7) D24.13(D6) D24.14(D5) D25.1(#:D1) D25.9(#:D3) D25.10(#:D2) D25.12(#:!TCU) D25.13(#:!TCD) D25.15(#:D0) D26.1(A:!CLK) D26.2(A:!CLR) D26.3(A:K) D26.5(B:!CLK) D26.6(B:!CLR) D26.7(B:J) D26.8(B:!Q) D26.10(B:K) D26.13(A:!Q) D26.14(A:J) D27.1(A:!CLK) D27.2(A:!CLR) D27.3(A:K) D27.5(B:!CLK) D27.6(B:!CLR) D27.7(B:J) D27.8(B:!Q) D27.9(B:Q) D27.10(B:K) D27.12(A:Q) D27.13(A:!Q) D27.14(A:J) D28.1(A:!CLK) D28.2(A:!CLR) D28.3(A:K) D28.6(B:!CLR) D28.8(B:!Q) D28.12(A:Q) D28.13(A:!Q) D28.14(A:J) D29.2(A:!CLR) D29.5(B:!CLK) D29.6(B:!CLR) D29.7(B:J) D29.8(B:!Q) D29.9(B:Q) D29.10(B:K) D29.13(A:!Q)

### Notes on the sheet
- 0-7 BPM Cycle Counter
- Astable NE555 / Source Clock Generator | Change Mode Counter
- TODO
  prescaler setter
  gate length setter
- TODO
  *Prescaler (1-16)
  *HS Counter for Load SR(0-15)
  *Mode Variation Counter(0-3)

## Sheet 8 of 10: Status LEDs
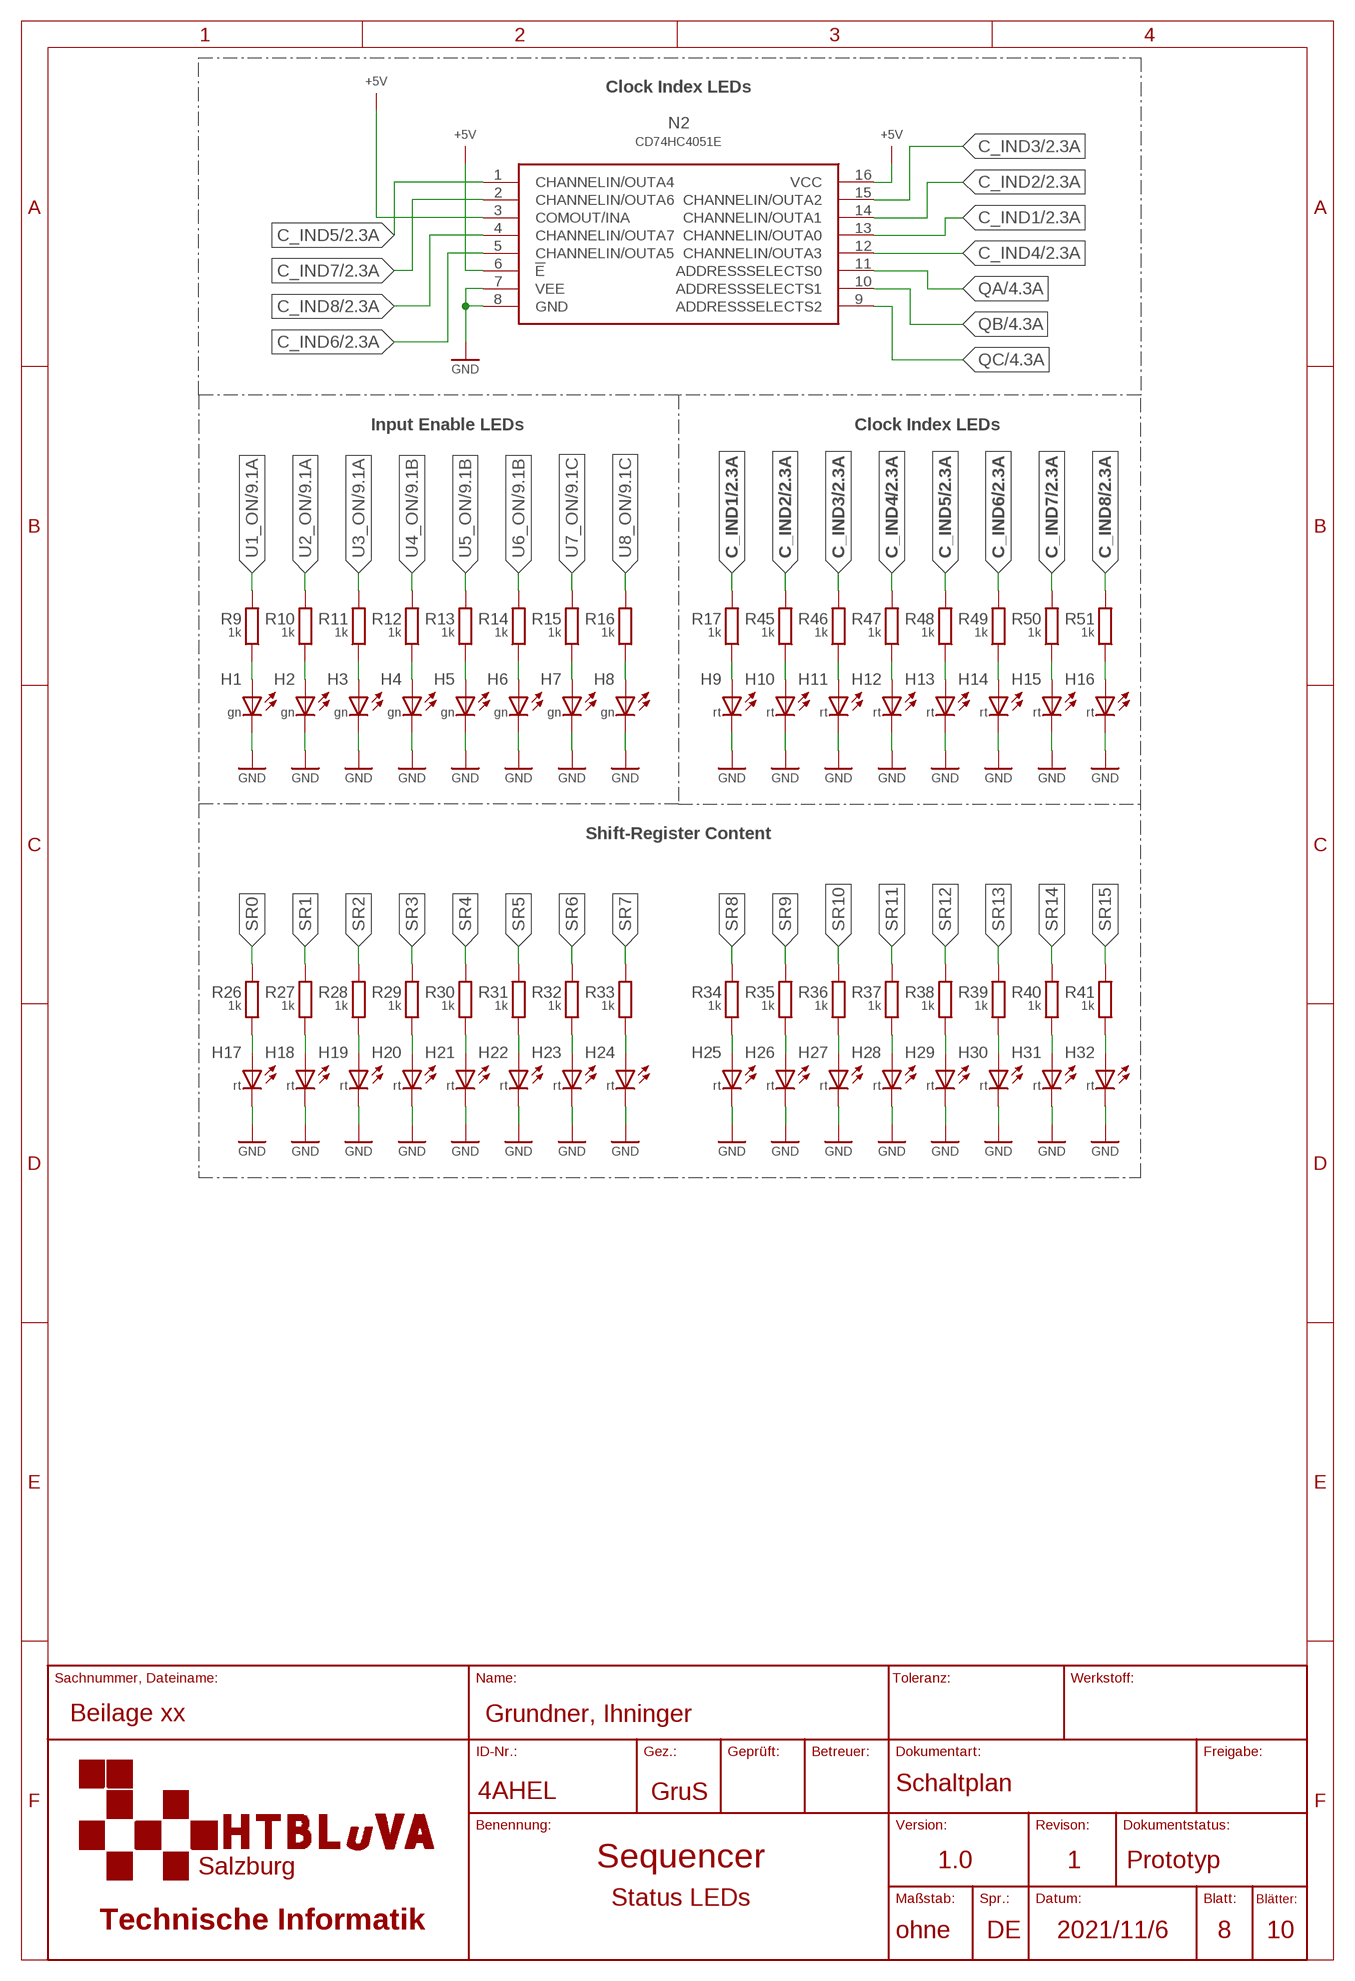
[diagram p7: schematic, sheet 8]

### Parts
H1  gn  LED5MM  [LED5MM]
H2  gn  LED5MM  [LED5MM]
H3  gn  LED5MM  [LED5MM]
H4  gn  LED5MM  [LED5MM]
H5  gn  LED5MM  [LED5MM]
H6  gn  LED5MM  [LED5MM]
H7  gn  LED5MM  [LED5MM]
H8  gn  LED5MM  [LED5MM]
H9  rt  LED5MM  [LED5MM]
H10  rt  LED5MM  [LED5MM]
H11  rt  LED5MM  [LED5MM]
H12  rt  LED5MM  [LED5MM]
H13  rt  LED5MM  [LED5MM]
H14  rt  LED5MM  [LED5MM]
H15  rt  LED5MM  [LED5MM]
H16  rt  LED5MM  [LED5MM]
H17  rt  LED3MM  [LED3MM]
H18  rt  LED3MM  [LED3MM]
H19  rt  LED3MM  [LED3MM]
H20  rt  LED3MM  [LED3MM]
H21  rt  LED3MM  [LED3MM]
H22  rt  LED3MM  [LED3MM]
H23  rt  LED3MM  [LED3MM]
H24  rt  LED3MM  [LED3MM]
H25  rt  LED3MM  [LED3MM]
H26  rt  LED3MM  [LED3MM]
H27  rt  LED3MM  [LED3MM]
H28  rt  LED3MM  [LED3MM]
H29  rt  LED3MM  [LED3MM]
H30  rt  LED3MM  [LED3MM]
H31  rt  LED3MM  [LED3MM]
H32  rt  LED3MM  [LED3MM]
N2  CD74HC4051E  [DIP16]
R9  1k  R-EUS0207/10  [0207/10]
R10  1k  R-EUS0207/10  [0207/10]
R11  1k  R-EUS0207/10  [0207/10]
R12  1k  R-EUS0207/10  [0207/10]
R13  1k  R-EUS0207/10  [0207/10]
R14  1k  R-EUS0207/10  [0207/10]
R15  1k  R-EUS0207/10  [0207/10]
R16  1k  R-EUS0207/10  [0207/10]
R17  1k  R-EUS0207/10  [0207/10]
R26  1k  R-EUS0207/10  [0207/10]
R27  1k  R-EUS0207/10  [0207/10]
R28  1k  R-EUS0207/10  [0207/10]
R29  1k  R-EUS0207/10  [0207/10]
R30  1k  R-EUS0207/10  [0207/10]
R31  1k  R-EUS0207/10  [0207/10]
R32  1k  R-EUS0207/10  [0207/10]
R33  1k  R-EUS0207/10  [0207/10]
R34  1k  R-EUS0207/10  [0207/10]
R35  1k  R-EUS0207/10  [0207/10]
R36  1k  R-EUS0207/10  [0207/10]
R37  1k  R-EUS0207/10  [0207/10]
R38  1k  R-EUS0207/10  [0207/10]
R39  1k  R-EUS0207/10  [0207/10]
R40  1k  R-EUS0207/10  [0207/10]
R41  1k  R-EUS0207/10  [0207/10]
R45  1k  R-EUS0207/10  [0207/10]
R46  1k  R-EUS0207/10  [0207/10]
R47  1k  R-EUS0207/10  [0207/10]
R48  1k  R-EUS0207/10  [0207/10]
R49  1k  R-EUS0207/10  [0207/10]
R50  1k  R-EUS0207/10  [0207/10]
R51  1k  R-EUS0207/10  [0207/10]

### Nets
+5V: N2.3(COMOUT/INA) N2.6(!E) N2.16(VCC) ; also sheet 4,5,6,7,9
C_IND1: N2.13(CHANNELIN/OUTA0) R17.2 ; also sheet 2
C_IND2: N2.14(CHANNELIN/OUTA1) R45.2 ; also sheet 2
C_IND3: N2.15(CHANNELIN/OUTA2) R46.2 ; also sheet 2
C_IND4: N2.12(CHANNELIN/OUTA3) R47.2 ; also sheet 2
C_IND5: N2.1(CHANNELIN/OUTA4) R48.2 ; also sheet 2
C_IND6: N2.5(CHANNELIN/OUTA5) R49.2 ; also sheet 2
C_IND7: N2.2(CHANNELIN/OUTA6) R50.2 ; also sheet 2
C_IND8: N2.4(CHANNELIN/OUTA7) R51.2 ; also sheet 2
GND: H1.K(C) H2.K(C) H3.K(C) H4.K(C) H5.K(C) H6.K(C) H7.K(C) H8.K(C) H9.K(C) H10.K(C) H11.K(C) H12.K(C) H13.K(C) H14.K(C) H15.K(C) H16.K(C) H17.K(C) H18.K(C) H19.K(C) H20.K(C) H21.K(C) H22.K(C) H23.K(C) H24.K(C) H25.K(C) H26.K(C) H27.K(C) H28.K(C) H29.K(C) H30.K(C) H31.K(C) H32.K(C) N2.7(VEE) N2.8(GND) ; also sheet 2,3,4,5,6,7,9,10
N$1: H9.A R17.1
N$9: H10.A R45.1
N$12: H1.A R9.1
N$13: H2.A R10.1
N$14: H3.A R11.1
N$15: H4.A R12.1
N$16: H5.A R13.1
N$17: H6.A R14.1
N$18: H7.A R15.1
N$19: H8.A R16.1
N$38: H11.A R46.1
N$51: H17.A R26.1
N$54: H18.A R27.1
N$56: H19.A R28.1
N$58: H20.A R29.1
N$60: H21.A R30.1
N$62: H22.A R31.1
N$64: H23.A R32.1
N$66: H24.A R33.1
N$68: H25.A R34.1
N$70: H26.A R35.1
N$72: H27.A R36.1
N$74: H28.A R37.1
N$75: H12.A R47.1
N$76: H13.A R48.1
N$77: H29.A R38.1
N$79: H30.A R39.1
N$81: H31.A R40.1
N$83: H32.A R41.1
N$84: H14.A R49.1
N$85: H15.A R50.1
N$93: H16.A R51.1
QA: N2.11(ADDRESSSELECTS0) ; also sheet 4,7
QB: N2.10(ADDRESSSELECTS1) ; also sheet 4,7
QC: N2.9(ADDRESSSELECTS2) ; also sheet 4,7
SR0: R26.2 ; also sheet 6
SR1: R27.2 ; also sheet 6
SR2: R28.2 ; also sheet 6
SR3: R29.2 ; also sheet 6
SR4: R30.2 ; also sheet 6
SR5: R31.2 ; also sheet 6
SR6: R32.2 ; also sheet 6
SR7: R33.2 ; also sheet 6
SR8: R34.2 ; also sheet 6
SR9: R35.2 ; also sheet 6
SR10: R36.2 ; also sheet 6
SR11: R37.2 ; also sheet 6
SR12: R38.2 ; also sheet 6
SR13: R39.2 ; also sheet 6
SR14: R40.2 ; also sheet 6
SR15: R41.2 ; also sheet 6
U1_ON: R9.2 ; also sheet 4,9
U2_ON: R10.2 ; also sheet 4,9
U3_ON: R11.2 ; also sheet 4,9
U4_ON: R12.2 ; also sheet 4,9
U5_ON: R13.2 ; also sheet 4,9
U6_ON: R14.2 ; also sheet 4,9
U7_ON: R15.2 ; also sheet 4,9
U8_ON: R16.2 ; also sheet 4,9

### Notes on the sheet
- Clock Index LEDs
- Input Enable LEDs | Clock Index LEDs
- Shift-Register Content

## Sheet 9 of 10: Switch Inputs Button or Toggle Inputs on Frontpanel
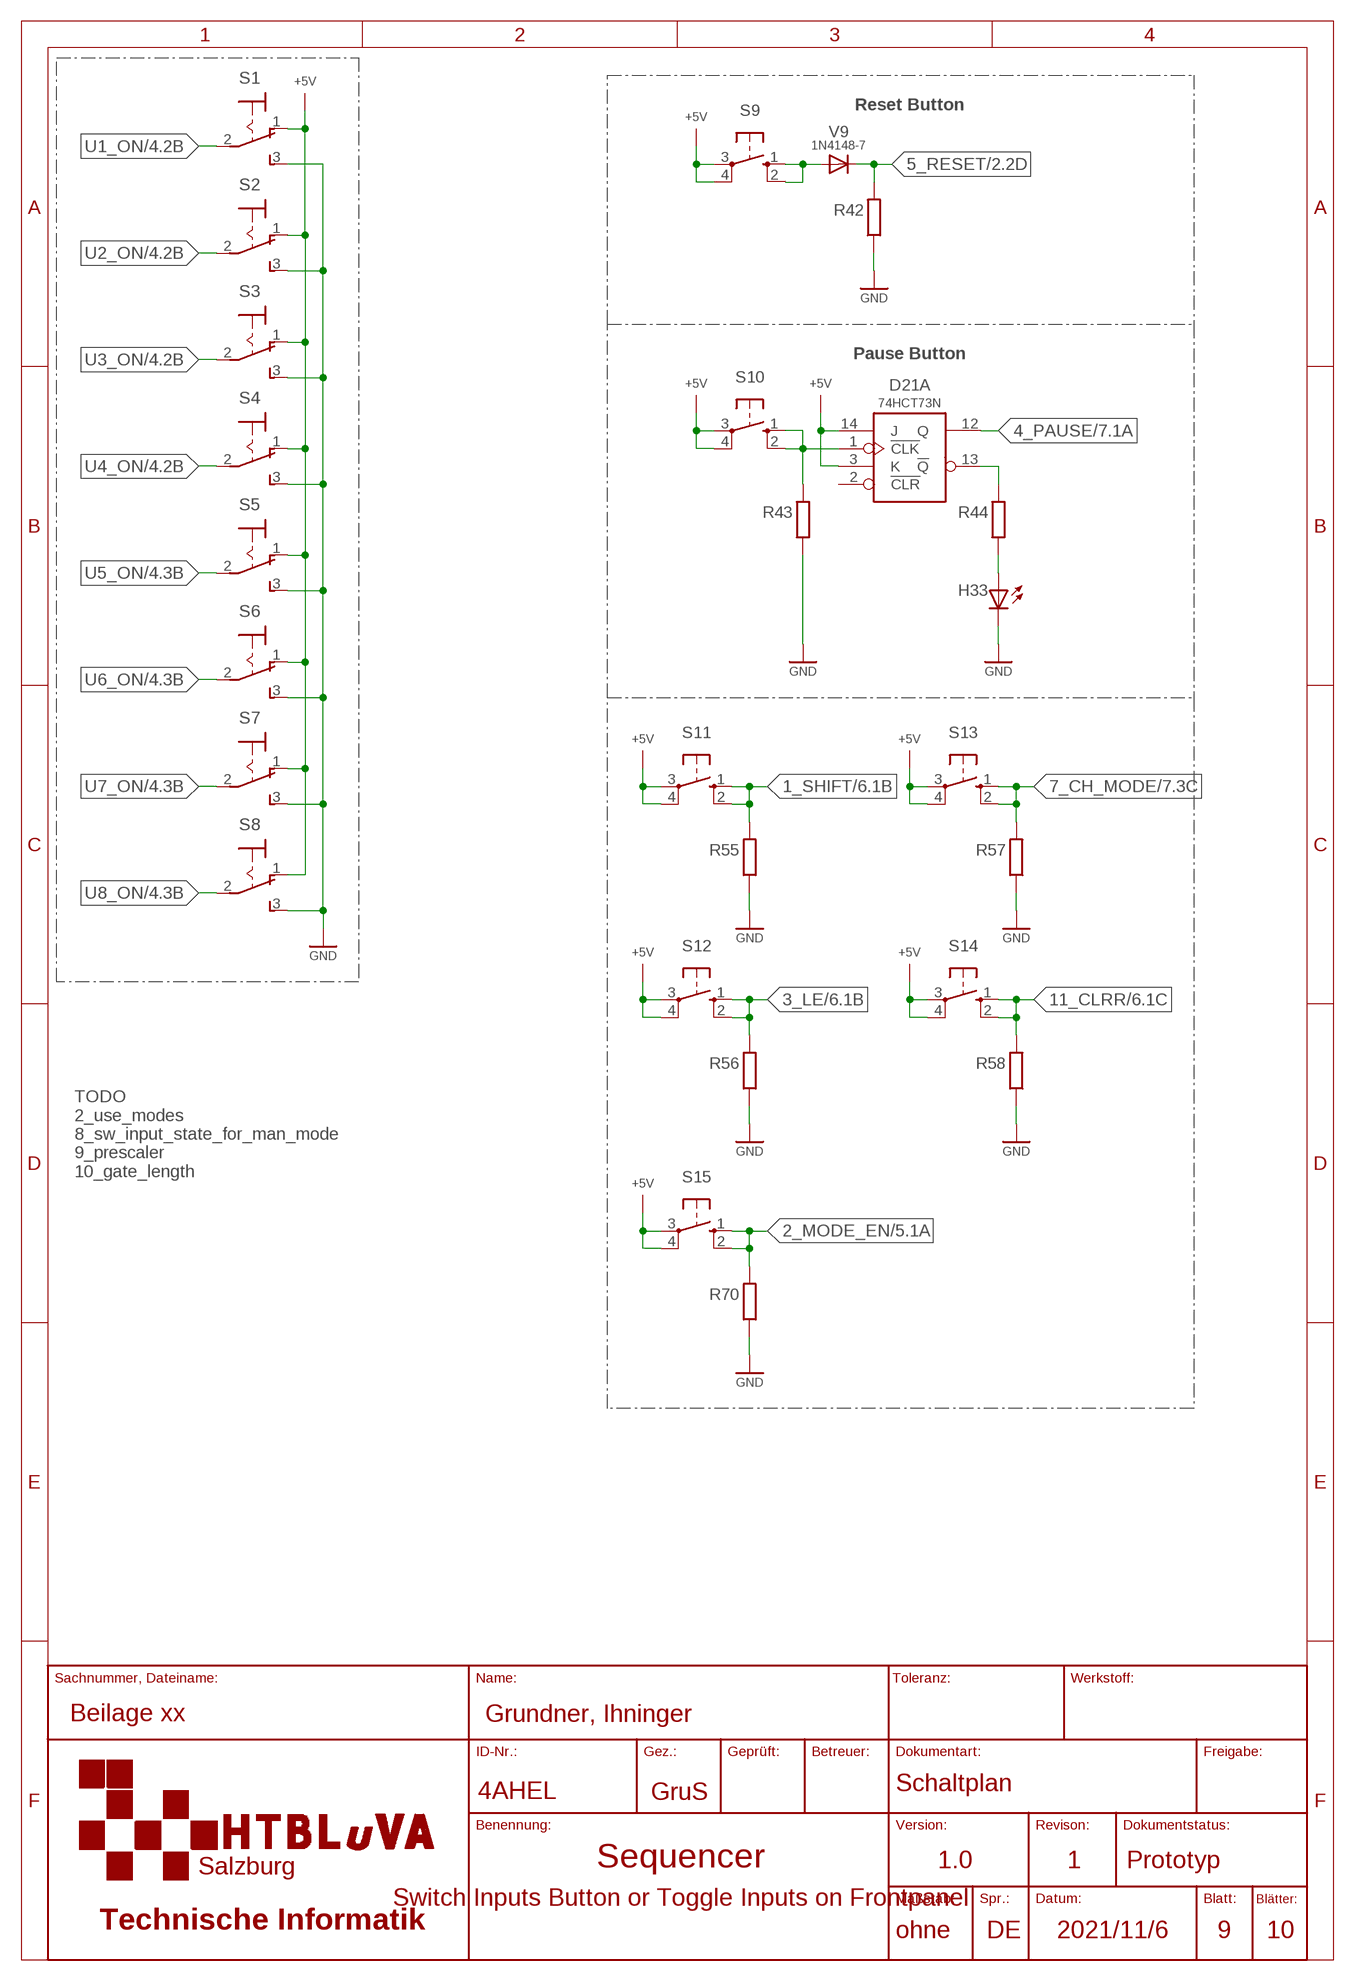
[diagram p8: schematic, sheet 9]

### Parts
D21  74HCT73N  [DIP14]
H33  LED5MM  [LED5MM]
R42  R-EUSR1206  [R1206]
R43  R-EUSR1206  [R1206]
R44  R-EUSR1206  [R1206]
R55  R-EUSR1206  [R1206]
R56  R-EUSR1206  [R1206]
R57  R-EUSR1206  [R1206]
R58  R-EUSR1206  [R1206]
R70  R-EUSR1206  [R1206]
S1  TSW1  [320-916]
S2  TSW1  [320-916]
S3  TSW1  [320-916]
S4  TSW1  [320-916]
S5  TSW1  [320-916]
S6  TSW1  [320-916]
S7  TSW1  [320-916]
S8  TSW1  [320-916]
S9  TASTE10-XX  [VERSTäRKER_B3F-10XX]
S10  TASTE10-XX  [VERSTäRKER_B3F-10XX]
S11  TASTE10-XX  [VERSTäRKER_B3F-10XX]
S12  TASTE10-XX  [VERSTäRKER_B3F-10XX]
S13  TASTE10-XX  [VERSTäRKER_B3F-10XX]
S14  TASTE10-XX  [VERSTäRKER_B3F-10XX]
S15  TASTE10-XX  [VERSTäRKER_B3F-10XX]
V9  1N4148-7  [DO35-7]

### Nets
1_SHIFT: R55.2 S11.1(S) S11.2(S1) ; also sheet 6
2_MODE_EN: R70.2 S15.1(S) S15.2(S1) ; also sheet 5
3_LE: R56.2 S12.1(S) S12.2(S1) ; also sheet 6
4_PAUSE: D21.12(A:Q) ; also sheet 7
5_RESET: R42.2 V9.C ; also sheet 2,7
7_CH_MODE: R57.2 S13.1(S) S13.2(S1) ; also sheet 7
11_CLRR: R58.2 S14.1(S) S14.2(S1) ; also sheet 6
+5V: D21.3(A:K) D21.14(A:J) S1.1(O) S2.1(O) S3.1(O) S4.1(O) S5.1(O) S6.1(O) S7.1(O) S8.1(O) S9.3(P) S9.4(P1) S10.3(P) S10.4(P1) S11.3(P) S11.4(P1) S12.3(P) S12.4(P1) S13.3(P) S13.4(P1) S14.3(P) S14.4(P1) S15.3(P) S15.4(P1) ; also sheet 4,5,6,7,8
GND: H33.K(C) R42.1 R43.1 R55.1 R56.1 R57.1 R58.1 R70.1 S1.3(S) S2.3(S) S3.3(S) S4.3(S) S5.3(S) S6.3(S) S7.3(S) S8.3(S) ; also sheet 2,3,4,5,6,7,8,10
N$7: H33.A R44.1
N$95: D21.1(A:!CLK) R43.2 S10.1(S) S10.2(S1)
N$103: S9.1(S) S9.2(S1) V9.A
N$105: D21.13(A:!Q) R44.2
U1_ON: S1.2(P) ; also sheet 4,8
U2_ON: S2.2(P) ; also sheet 4,8
U3_ON: S3.2(P) ; also sheet 4,8
U4_ON: S4.2(P) ; also sheet 4,8
U5_ON: S5.2(P) ; also sheet 4,8
U6_ON: S6.2(P) ; also sheet 4,8
U7_ON: S7.2(P) ; also sheet 4,8
U8_ON: S8.2(P) ; also sheet 4,8
Unconnected: D21.2(A:!CLR) D21.5(B:!CLK) D21.6(B:!CLR) D21.7(B:J) D21.8(B:!Q) D21.9(B:Q) D21.10(B:K)

### Notes on the sheet
- Reset Button
- Pause Button
- TODO
  2_use_modes
  8_sw_input_state_for_man_mode
  9_prescaler
  10_gate_length

## Sheet 10 of 10: ADSR Envelope Generator
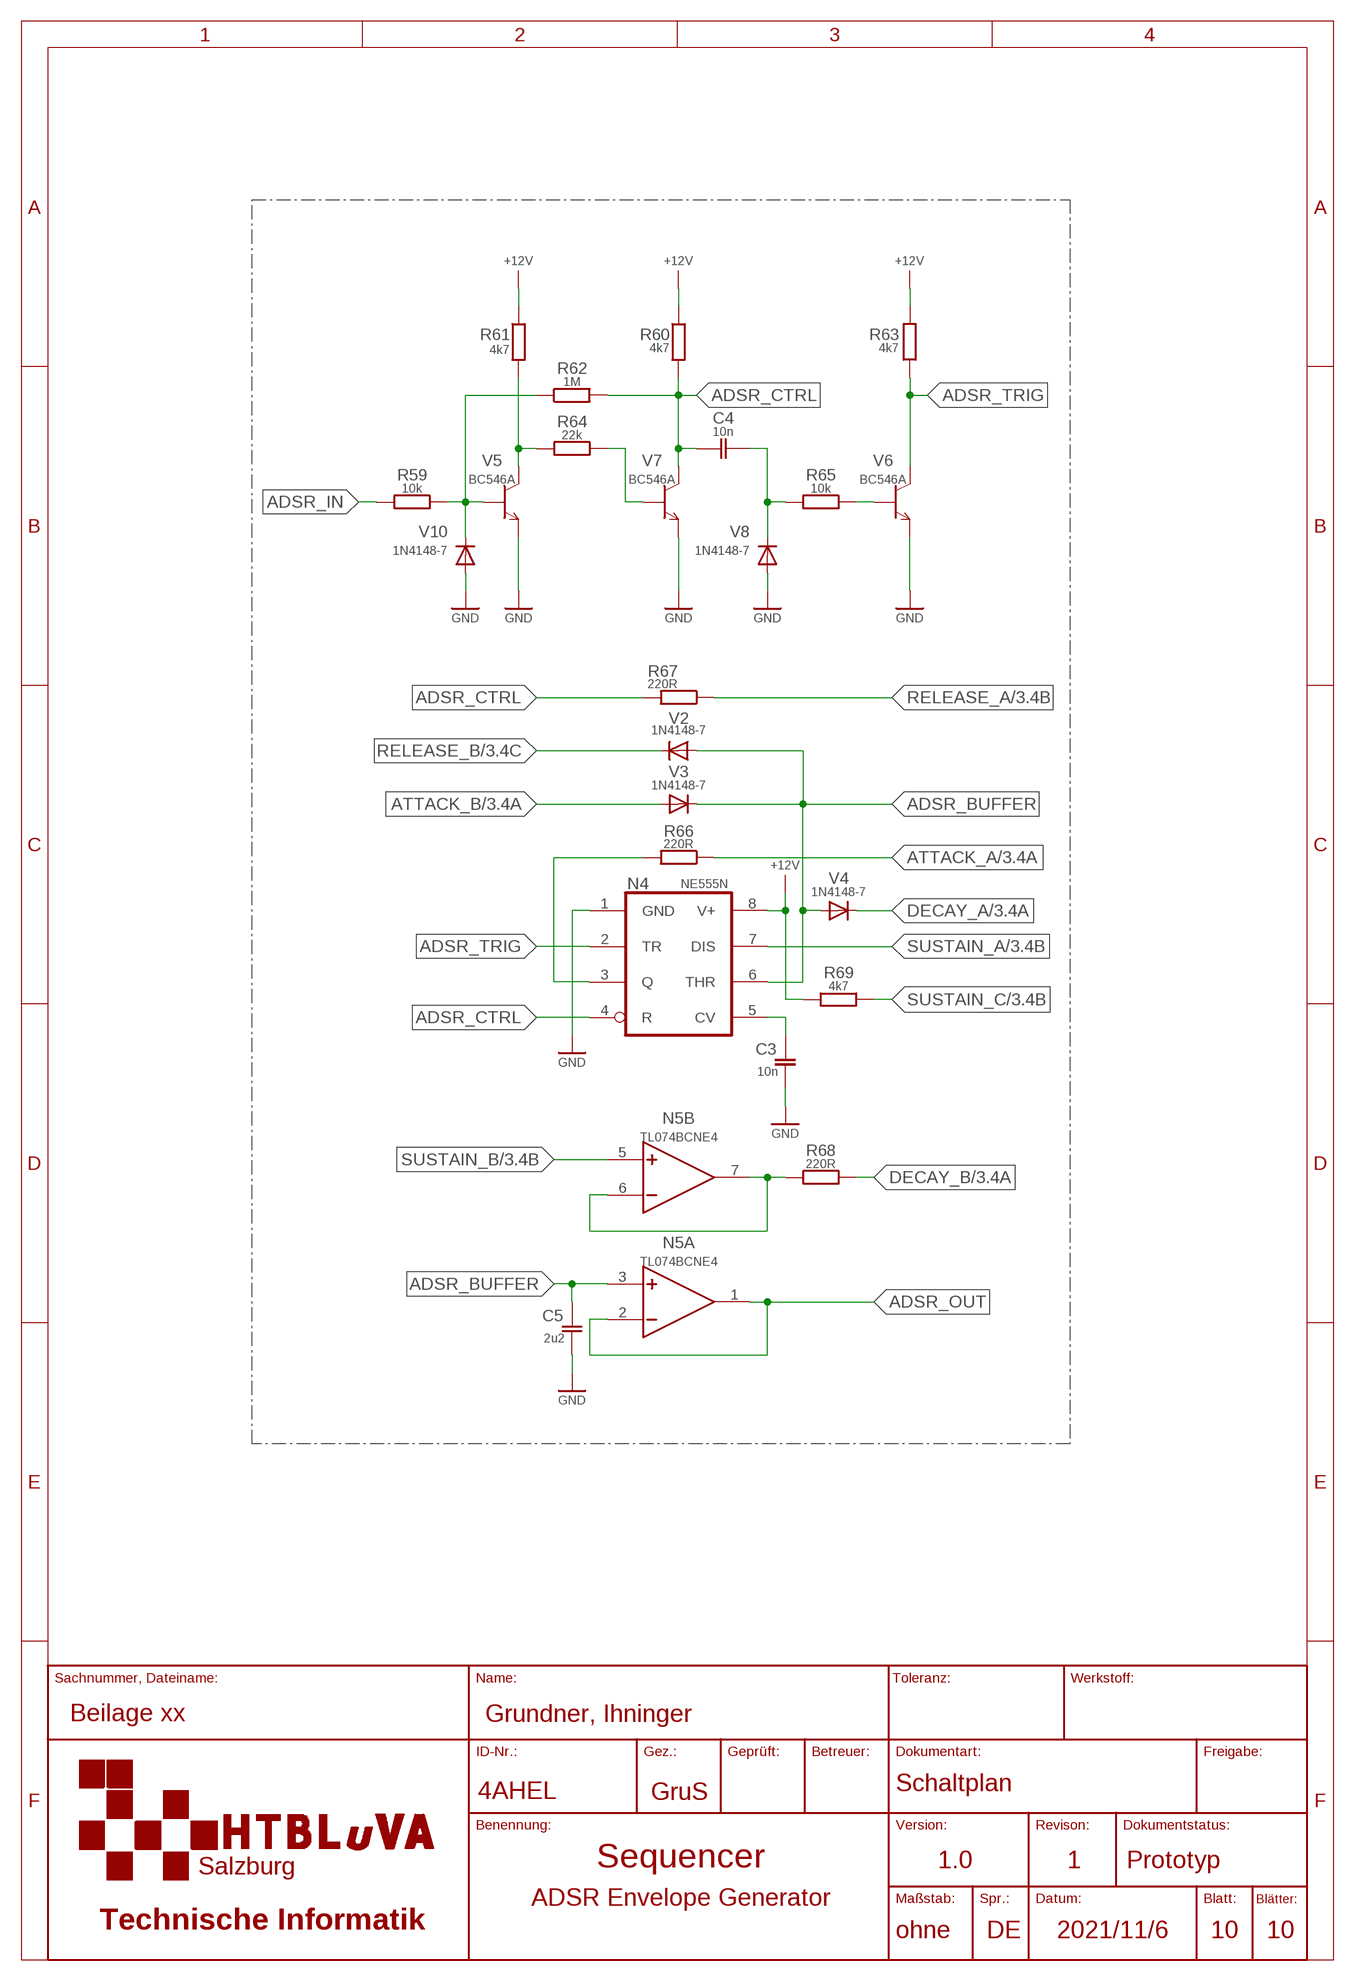
[diagram p9: schematic, sheet 10]

### Parts
C3  10n  C-EU050-025X075  [C050-025X075]
C4  10n  C-EU050-025X075  [C050-025X075]
C5  2u2  C-EU050-025X075  [C050-025X075]
N4  NE555N  [DIL08]
N5  TL074BCNE4  [DIL14]
R59  10k  R-EUSR1206  [R1206]
R60  4k7  R-EUSR1206  [R1206]
R61  4k7  R-EUSR1206  [R1206]
R62  1M  R-EUSR1206  [R1206]
R63  4k7  R-EUSR1206  [R1206]
R64  22k  R-EUSR1206  [R1206]
R65  10k  R-EUSR1206  [R1206]
R66  220R  R-EUSR1206  [R1206]
R67  220R  R-EUSR1206  [R1206]
R68  220R  R-EUSR1206  [R1206]
R69  4k7  R-EUSR1206  [R1206]
V2  1N4148-7  [DO35-7]
V3  1N4148-7  [DO35-7]
V4  1N4148-7  [DO35-7]
V5  BC546A  [TO92-123]
V6  BC546A  [TO92-123]
V7  BC546A  [TO92-123]
V8  1N4148-7  [DO35-7]
V10  1N4148-7  [DO35-7]

### Nets
+12V: N4.8(V+) R60.1 R61.1 R63.2 R69.2
ADSR_BUFFER: C5.1 N4.6(THR) N5.3(A:P) V2.A V3.C V4.A
ADSR_CTRL: C4.1 N4.4(R) R60.2 R62.2 R67.2 V7.1(C)
ADSR_IN: R59.2
ADSR_OUT: N5.1(A:O) N5.2(A:N)
ADSR_TRIG: N4.2(TR) R63.1 V6.1(C)
ATTACK_A: R66.1 ; also sheet 3
ATTACK_B: V3.A ; also sheet 3
DECAY_A: V4.C ; also sheet 3
DECAY_B: R68.1 ; also sheet 3
GND: C3.2 C5.2 N4.1(GND) V5.3(E) V6.3(E) V7.3(E) V8.A V10.A ; also sheet 2,3,4,5,6,7,8,9
N$8: N4.3(Q) R66.2
N$102: C3.1 N4.5(CV)
N$114: N5.6(B:N) N5.7(B:O) R68.2
N$119: R65.1 V6.2(B)
N$121: C4.2 R65.2 V8.C
N$123: R64.1 V7.2(B)
N$124: R61.2 R64.2 V5.1(C)
N$125: R59.1 R62.1 V5.2(B) V10.C
RELEASE_A: R67.1 ; also sheet 3
RELEASE_B: V2.C ; also sheet 3
SUSTAIN_A: N4.7(DIS) ; also sheet 3
SUSTAIN_B: N5.5(B:P) ; also sheet 3
SUSTAIN_C: R69.1 ; also sheet 3
Unconnected: N5.8(C:O) N5.9(C:N) N5.10(C:P) N5.12(D:P) N5.13(D:N) N5.14(D:O)

## Power pins joined to a net without a drawn wire
GND: D1.8(/P:GND) D6.7(/P:GND) D7.7(/P:GND) D8.11(/P:GND) D9.7(/P:GND) D13.11(/P:GND) D14.7(/P:GND) D15.7(/P:GND) D16.7(/P:GND) D17.7(/P:GND) D18.7(/P:GND) D19.10(/P:GND) D20.7(/P:GND) D21.11(/P:GND) D22.7(/P:GND) D25.8(/P:GND) D26.11(/P:GND) D27.11(/P:GND) D28.11(/P:GND) D29.11(/P:GND) IC3.8(GND) IC4.8(GND)
VCC: D1.16(/P:VCC) D6.14(/P:VCC) D7.14(/P:VCC) D8.4(/P:VCC) D9.14(/P:VCC) D13.4(/P:VCC) D14.14(/P:VCC) D15.14(/P:VCC) D16.14(/P:VCC) D17.14(/P:VCC) D18.14(/P:VCC) D19.20(/P:VCC) D20.14(/P:VCC) D21.4(/P:VCC) D22.14(/P:VCC) D25.16(/P:VCC) D26.4(/P:VCC) D27.4(/P:VCC) D28.4(/P:VCC) D29.4(/P:VCC) IC3.16(VCC) IC4.16(VCC) N5.4(P:VCC)
VSS: N5.11(P:VSS)

## Library data of the parts
C1-C5 = rcl_GruS:C-EU: CAPACITOR, European symbol
D1 D25 = 74xx_GruS:74*193: 74HC(T)193 - Presettable synchronous 4-bit binary up, down counter@en-us Source: Datasheet <https://assets.nexperia.com/documents/data-sheet/74HC_HCT193.pdf>
D2 D3 = adc-dac_GruS:ADC0820CC: TEXAS INSTRUMENTS - ADC0820CCN/NOPB - Analogue to Digital Converter, 8 bit, 667 kSPS, Single Ended, Parallel, Single, 4.5 V Source: Datasheet <https://media.digikey.com/pdf/Data Sheets/Texas Instruments PDFs/ADC0820-N.pdf>; ARROW_PART_NUMBER: ADC0820CCN/NOPB; ARROW_PRICE-STOCK: https://www.arrow.com/en/products/adc0820ccnnopb/texas-instruments; DESCRIPTION: TEXAS INSTRUMENTS - ADC0820CCN/NOPB - Analogue to Digital Converter, 8 bit, 667 kSPS, Single Ended, Parallel, Single, 4.5 V; HEIGHT: 5.08mm; MANUFACTURER_NAME: Texas Instruments; MANUFACTURER_PART_NUMBER: ADC0820CCN/NOPB; MOUSER_PART_NUMBER: 926-ADC0820CCN/NOPB; MOUSER_PRICE-STOCK: https://www.mouser.com/Search/Refine.aspx?Keyword=926-ADC0820CCN%2FNOPB
D4 D11 D12 D23 D24 = mux_GruS:SN74HC151: Encoders, Decoders, Multiplexers & Demultiplexers 8-1 Line Data Selctr Source: Datasheet <https://www.ti.com/lit/gpn/SN74HC151>; DESCRIPTION: Encoders, Decoders, Multiplexers & Demultiplexers 8-1 Line Data Selctr; HEIGHT: 5.08mm; MANUFACTURER_NAME: Texas Instruments; MANUFACTURER_PART_NUMBER: SN74HC151N; MOUSER_PART_NUMBER: 595-SN74HC151N; MOUSER_PRICE-STOCK: https://www.mouser.co.uk/ProductDetail/Texas-Instruments/SN74HC151N?qs=st7IWvlL5%2FgZ0EYsqHF4AQ%3D%3D
D5 D10 = adc-dac_GruS:TLC7524C: 8-Bit, 0.1 us MDAC, Parallel Input, Fast Control Signalling for DSP, Easy Micro Interface Source: Datasheet <http://uk.rs-online.com/web/p/products/0650087>; DESCRIPTION: 8-Bit, 0.1 us MDAC, Parallel Input, Fast Control Signalling for DSP, Easy Micro Interface; HEIGHT: 5.08mm; MANUFACTURER_NAME: Texas Instruments; MANUFACTURER_PART_NUMBER: TLC7524CN; RS_PART_NUMBER: 0650087; RS_PRICE-STOCK: http://uk.rs-online.com/web/p/products/0650087
D6 D7 D15 D20 D22 = 74xx_GruS:74*08: Quad 2-Input Logic AND Datasheet Dist.: Art. Nr.:
D8 D13 D21 D26-D29 = 74xx_GruS:74*73: Dual JK-FlipFlop Datasheet Dist.: Art. Nr.:
D9 D14 D16 = 74xx_GruS:74*32: Quad 2-Input Logic OR Datasheet Dist.: Art. Nr.:
D17 D18 = 74xx_GruS:74*00: Quad 2-Input Logic NAND Datasheet Dist.: Art. Nr.:
D19 = 74xx_GruS:74*573: High Speed CMOS Logic Octal Transparent Latches with 3-State Outputs Source: Datasheet <http://www.ti.com/lit/gpn/cd74hct573>
H1-H34 = led_GruS:LED: LED, EN-60617 OSRAM: - CHIPLED LG R971, LG N971, LY N971, LG Q971, LY Q971, LO R971, LY R971 LH N974, LH R974 LS Q976, LO Q976, LY Q976 LO Q996 - Hyper CHIPLED LW Q18S LB Q993, LB Q99A, LB R99A - SideLED LS A670, LO A670, LY A670, LG A670, LP A670 LB A673, LV A673, LT A673, LW A673 LH A674 LY A675 LS A676, LA A676, LO A676, LY A676, LW A676 LS A679, LY A679, LG A679 - Hyper Micro SIDELED® LS Y876, LA Y876, LO Y876, LY Y876 LT Y87S - SmartLED LW L88C, LW L88S LB L89C, LB L89S, LG L890 LS L89K, LO L89K, LY L89K LS L896, LA L896, LO L896, LY L896 - TOPLED LS T670, LO T670, LY T670, LG T670, LP T670 LSG T670, LSP T670, LSY T670, LOP T670, LYG T670 LG T671, LOG T671, LSG T671 LB T673, LV T673, LT T673, LW T673 LH T674 LS T676, LA T676, LO T676, LY T676, LB T676, LH T676, LSB T676, LW T676 LB T67C, LV T67C, LT T67C, LS T67K, LO T67K, LY T67K, LW E67C LS E67B, LA E67B, LO E67B, LY E67B, LB E67C, LV E67C, LT E67C LW T67C LS T679, LY T679, LG T679 LS T770, LO T770, LY T770, LG T770, LP T770 LB T773, LV T773, LT T773, LW T773 LH T774 LS E675, LA E675, LY E675, LS T675 LS T776, LA T776, LO T776, LY T776, LB T776 LHGB T686 LT T68C, LB T68C - Hyper Mini TOPLED® LB M676 - Mini TOPLED Santana® LG M470 LS M47K, LO M47K, LY M47K Source: http://www.osram.convergy.de LUXEON: - LUMILED® LXK2-PW12-R00, LXK2-PW12-S00, LXK2-PW14-U00, LXK2-PW14-V00 LXK2-PM12-R00, LXK2-PM12-S00, LXK2-PM14-U00 LXK2-PE12-Q00, LXK2-PE12-R00, LXK2-PE12-S00, LXK2-PE14-T00, LXK2-PE14-U00 LXK2-PB12-K00, LXK2-PB12-L00, LXK2-PB12-M00, LXK2-PB14-N00, LXK2-PB14-P00, LXK2-PB14-Q00 LXK2-PR12-L00, LXK2-PR12-M00, LXK2-PR14-Q00, LXK2-PR14-R00 LXK2-PD12-Q00, LXK2-PD12-R00, LXK2-PD12-S00 LXK2-PH12-R00, LXK2-PH12-S00 LXK2-PL12-P00, LXK2-PL12-Q00, LXK2-PL12-R00 Source: www.luxeon.com KINGBRIGHT: KA-3528ASYC Source: www.kingbright.com
IC3 IC4 = 74xx_GruS:74*595: 8-bit shift register,74HC595N DIP16, TU Source: Datasheet <https://datasheet.datasheetarchive.com/originals/distributors/SFDatasheet-4/sf-00080087.pdf>
J1-J9 = con_GruS:35RAPC2AH3: Phone Connectors 3.5MM MONO JACK HOR Source: Datasheet <http://www.switchcraft.com/Drawings/35rapc__h3_cd.pdf>; DESCRIPTION: Phone Connectors 3.5MM MONO JACK HOR; HEIGHT: 6.254mm; MANUFACTURER_NAME: Switchcraft; MANUFACTURER_PART_NUMBER: 35RAPC2AH3; MOUSER_PART_NUMBER: 502-35RAPC2AH3; MOUSER_PRICE-STOCK: https://www.mouser.co.uk/ProductDetail/Switchcraft/35RAPC2AH3?qs=tCUFd3%252B19IP5bD6uJku1Jg%3D%3D
N1 N2 = mux_GruS:CD74HC4051: CD74HC4051E, Multiplexer/Demultiplexer Single 8:1, 3 V, 5 V, 16-Pin, PDIP, 1 Source: Datasheet <http://www.ti.com/lit/ds/symlink/cd74hc4051.pdf>
N3 N4 = linear_GruS:NE555: TIMER Datasheet <http://www.ti.com/general/docs/suppproductinfo.tsp?distId=26&gotoUrl=http%3A%2F%2Fwww.ti.com%2Flit%2Fgpn%2Fne555> Dist.: Mouser <www.mouser.at> Art. Nr.: 595-NE555P
N5 = opv_GruS:TL074BCNE4: Operational Amplifiers - Op Amps Low-Noise JFET-Input Op Amp Source: Datasheet <http://www.ti.com/lit/ds/symlink/tl074b.pdf>
R1-R8 R18-R25 = rcl_GruS:R-POT: Datasheet P160 <https://www.ttelectronics.com/TTElectronics/media/ProductFiles/Datasheets/P160.pdf> DigiKey Collection <https://www.digikey.com/en/products/filter/rotary-potentiometers-rheostats/84?s=N4IgjCBcoEwCxVAYygMwIYBsDOBTANCAPZQDaIcADDAGxgwgC6hADgC5QgDKbATgJYA7AOYgAvoRoBORCBSQMOAsTIgAzAA41NAKwNmIdpx4CR4wjB0bZ8xXkIlI5TXA1WmrDpG58hoiSA6agjQcmhY9ipO6gDslDQaEAZG3iZ%2B5oFwOjbhSg6q2jAxGpQehl4%2Bpv6EGlI0OQoRyo7OJcEIyRVpZgFglFoNds0FajCJ1p3Gvj2EfVIMobZN%2BdHaOmBgHZ5TVRlgGnAyi7mRLeBlKSAAkoJsuMK4vHtStYPLUeSlk6nT1SAwMH2bzyH3O3xAABEiABXABGmFwGQAtCFkCdhtFLBpLEwAkjssdGiCzmAYrjCEiIIShityC8yYwxEygA>
R9-R17 R26-R70 = rcl_GruS:R-EUS: RESISTOR, European symbol
S1-S8 = switch_GruS:TSW1: TOGGLE SWITCH RS Components Best. Nr.: 320-916
S9-S15 = switch_GruS:TASTE10-XX: OMRON SWITCH
SV1 SV2 = con-lstb:MA08-1W: PIN HEADER; OC_FARNELL: unknown; OC_NEWARK: unknown
SV3 SV4 = con-lsta:FE08-1: FEMALE HEADER; OC_FARNELL: unknown; OC_NEWARK: unknown
V1-V4 V8-V10 = diode_GruS:1N4148: DIODE, EN-60617, high speed Datasheet <https://docs.rs-online.com/f692/0900766b80896c7b.pdf> Dist.: RS Components <https://at.rs-online.com> Art. Nr.: 146-2253
V5-V7 = transistor_GruS:BC546*: NPN Transistor Datasheet <https://docs.rs-online.com/c27f/0900766b814a51bf.pdf> Dist.: RS Components <https://at.rs-online.com> Art. Nr.: 761-9825
X1 X3 X4 X7 X9 X10 X13 X19 = con-lstb:MA02-1: PIN HEADER
X2 X6 X11 X12 X14 X16 X17 X20 = con-lsta:FE02-1: 2x1 Female Headers
X5 X8 = con-lstb:MA03-1W
X15 X18 = con-lsta:FE03-1